# EAGLE schematic MPC_celltesterV1.0 (EAGLE 9.6.2)
DESIGNER: Juan J. Rojas; INSTITUTION: Instituto Tecnológico de Costa Rica; PROJECT_NAME: BDC_Prototype; VERSION: 1.1
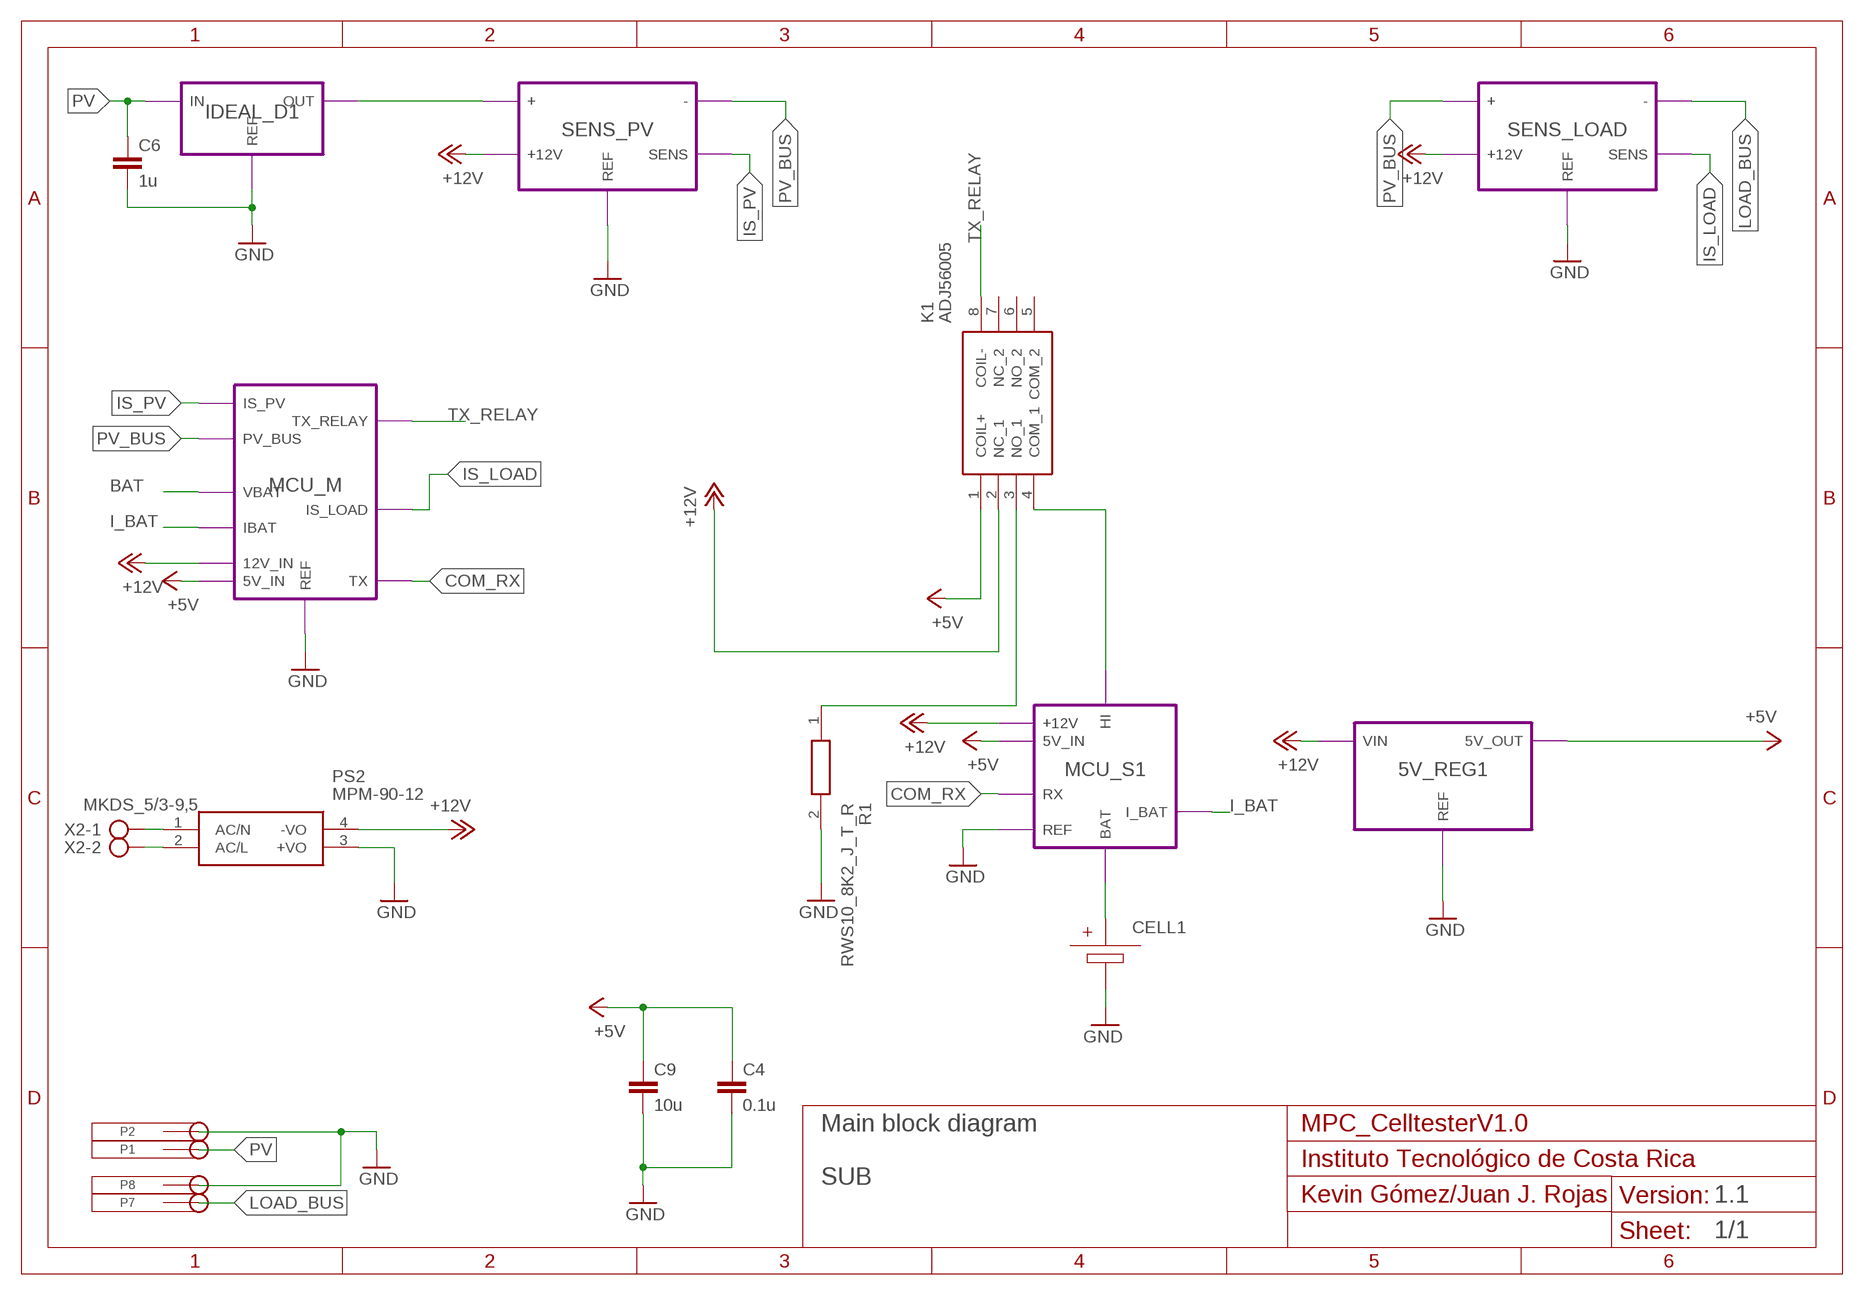
[diagram p0: schematic, sheet 1]
FRAME1 (A4L-JUANJO): DESIGNER: Kevin Gómez/Juan J. Rojas; PROJECT_NAME: MPC_CelltesterV1.0; SUBTITLE: SUB; TITLE: Main block diagram

## Parts
C4  0.1u  NONPOL_CAP-0603  [C0603]
C6  1u  NONPOL_CAP-0603  [C0603]
C9  10u  NONPOL_CAP-0603  [C0603]
CELL1  CELL18650_HOLDER  [18650_HOLDER]
K1  ADJ56005  [ADJ56005]
P1  TJ-563  [TJ-563]
P2  TJ-563  [TJ-563]
P7  TJ-563  [TJ-563]
P8  TJ-563  [TJ-563]
PS2  MPM-90-12  [MPM9012]
R1  RWS10_8K2_J_T_R  [RWS108K2JTR]
X2  MKDS_5/3-9,5  [MKDS_5/3-950]

## Module instances
MCU_S1 = BIDIRECTIONAL_CONVERTER (part numbers offset by 100)
SENS_PV = BI_CURR_MEAS (part numbers offset by 500)
SENS_LOAD = BI_CURR_MEAS (part numbers offset by 600)
5V_REG1 = 5V_REGULATOR (part numbers offset by 800)
IDEAL_D1 = IDEAL_DIODE (part numbers offset by 1100)
MCU_M = CONTROLLER$A

## Nets
+5V: C4.1 C9.1 K1.1(COIL+) ; port 5V_REG1.5V_OUT MCU_S1.5V_IN MCU_M.5V_IN
+12V: K1.2(NC_1) PS2.4(-VO) ; port MCU_M.12V_IN MCU_S1.+12V SENS_PV.+12V SENS_LOAD.+12V 5V_REG1.VIN
BAT: port MCU_M.VBAT
COM_RX: port MCU_S1.RX MCU_M.TX
GND: C4.2 C6.2 C9.2 CELL1.BB1.N(-) P2.P(PIN) P8.P(PIN) PS2.3(+VO) R1.2 ; port MCU_S1.REF SENS_PV.REF SENS_LOAD.REF IDEAL_D1.REF 5V_REG1.REF MCU_M.REF
I_BAT: port MCU_M.IBAT MCU_S1.I_BAT
IS_LOAD: port SENS_LOAD.SENS MCU_M.IS_LOAD
IS_PV: port SENS_PV.SENS MCU_M.IS_PV
LOAD_BUS: P7.P(PIN) ; port SENS_LOAD.-
N$1: CELL1.BB1.P(+) ; port MCU_S1.BAT
N$2: K1.3(NO_1) R1.1
N$3: PS2.1(AC/N) X2.1
N$4: PS2.2(AC/L) X2.2
N$6: port SENS_PV.+ IDEAL_D1.OUT
PV: C6.1 P1.P(PIN) ; port IDEAL_D1.IN
PV_BUS: K1.4(COM_1) ; port SENS_PV.- SENS_LOAD.+ MCU_M.PV_BUS
TX_RELAY: K1.8(COIL-) ; port MCU_M.TX_RELAY
Unconnected: K1.5(COM_2) K1.6(NO_2) K1.7(NC_2) X2.3

## Library data of the parts
C4 C6 C9 = Pasives:NONPOL_CAP
CELL1 = Sources:CELL
K1 = ADJ56005:ADJ56005: General Purpose Relays 2 Form C, 5VDC Single-Side-Stable Source: Datasheet <https://www.arrow.com/en/products/adj56005/panasonic>; ARROW_PART_NUMBER: ADJ56005; ARROW_PRICE-STOCK: https://www.arrow.com/en/products/adj56005/panasonic; DESCRIPTION: General Purpose Relays 2 Form C, 5VDC Single-Side-Stable; HEIGHT: 16.8mm; MANUFACTURER_NAME: Panasonic; MANUFACTURER_PART_NUMBER: ADJ56005; MOUSER_PART_NUMBER: 769-ADJ56005; MOUSER_PRICE-STOCK: https://www.mouser.co.uk/ProductDetail/Panasonic-Industrial-Devices/ADJ56005?qs=K19snyAz2PDLYPJLi5JsPw%3D%3D
P1 P2 P7 P8 = Interfaces:TJ-563
PS2 = MPM-90-12:MPM-90-12: AC/DC Power Modules 80.4W 12V 6.7A PCB Mnt Medical Source: Datasheet <https://www.meanwell.com/webapp/product/search.aspx?prod=MPM-90#1>; ARROW_PART_NUMBER: MPM-90-12; ARROW_PRICE-STOCK: https://www.arrow.com/en/products/mpm-90-12/mean-well-enterprises; DESCRIPTION: AC/DC Power Modules 80.4W 12V 6.7A PCB Mnt Medical; HEIGHT: 29.5mm; MANUFACTURER_NAME: Mean Well; MANUFACTURER_PART_NUMBER: MPM-90-12; MOUSER_PART_NUMBER: 709-MPM-90-12; MOUSER_PRICE-STOCK: https://www.mouser.co.uk/ProductDetail/MEAN-WELL/MPM-90-12?qs=GBLSl2AkirsaepJLNG9d8w%3D%3D
R1 = RWS10_8K2_J_T&R:RWS10_8K2_J_T_R: Precision Power Wirewound SMD Resistors Source: Datasheet <https://www.mouser.es/datasheet/2/303/RWS710-1-12.41-768831.pdf>; DESCRIPTION: Precision Power Wirewound SMD Resistors; HEIGHT: 13mm; MANUFACTURER_NAME: Arcol; MANUFACTURER_PART_NUMBER: RWS10 8K2 J T&R
X2 = con-phoenix-mkds_5:MKDS_5/3-: MKDS 5/3-6,35 Source: PHOENIX CONTACT; MF: FARNELL; MPN: 1714984; OC_FARNELL: 3704713; OC_NEWARK: 71C4094

## Module BIDIRECTIONAL_CONVERTER
Ports: REF(pwr) HI(io) +12V(pwr) 5V_IN(pwr) RX(io) BAT(io) I_BAT(io)
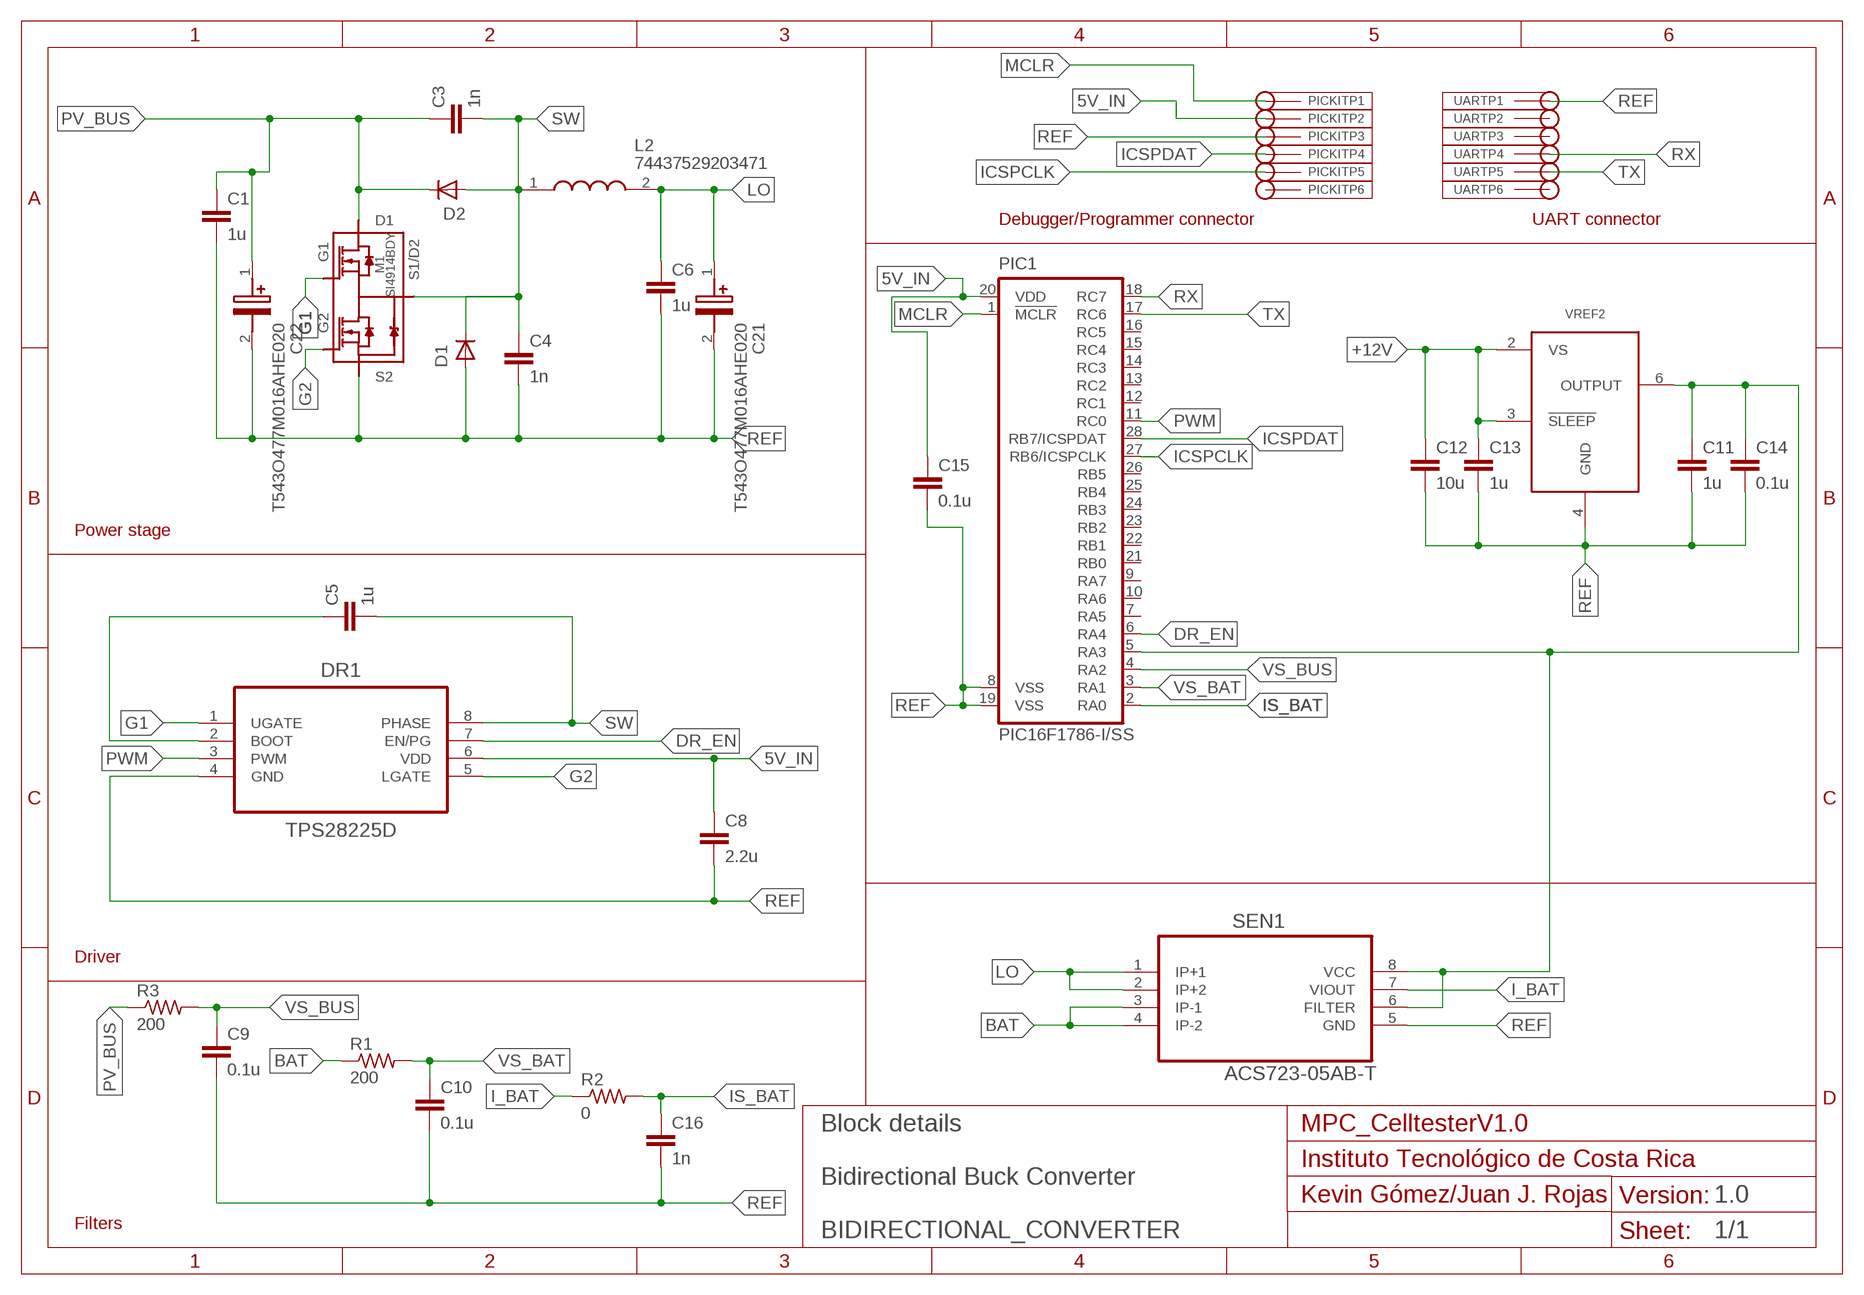
[diagram p1: schematic, module BIDIRECTIONAL_CONVERTER, sheet 1]
FRAME1 (A4L-JUANJO): DESIGNER: Kevin Gómez/Juan J. Rojas; PROJECT_NAME: MPC_CelltesterV1.0; SUBTITLE: Bidirectional Buck Converter; TITLE: Block details; VERSION: 1.0

### Parts
C1  1u  NONPOL_CAP-0603  [C0603]
C3  1n  NONPOL_CAP-0603  [C0603]
C4  1n  NONPOL_CAP-0603  [C0603]
C5  1u  NONPOL_CAP-0603  [C0603]
C6  1u  NONPOL_CAP-0603  [C0603]
C8  2.2u  NONPOL_CAP-0603  [C0603]
C9  0.1u  NONPOL_CAP-0603  [C0603]
C10  0.1u  NONPOL_CAP-0603  [C0603]
C11  1u  NONPOL_CAP-0603  [C0603]
C12  10u  NONPOL_CAP-0603  [C0603]
C13  1u  NONPOL_CAP-0603  [C0603]
C14  0.1u  NONPOL_CAP-0603  [C0603]
C15  0.1u  NONPOL_CAP-0603  [C0603]
C16  1n  NONPOL_CAP-0603  [C0603]
C21  T543O477M016AHE020  [CAPPM7360X430N]
C22  T543O477M016AHE020  [CAPPM7360X430N]
D1  DIODE-SMB  [SMB]
D2  DIODE-SMB  [SMB]
DR1  TPS28225D  [SOIC-8]
L2  74437529203471  [74437529203221]
M1  SI4914BDY  [SOIC-8]
PIC1  PIC16F1786-I/SS  [SSOP28]
PICKIT  MA06-1  [MA06-1]
R1  200  RESISTOR-0603  [R0603]
R2  0  RESISTOR-0603  [R0603]
R3  200  RESISTOR-0603  [R0603]
SEN1  ACS723-05AB-T  [SOIC-8]
UART  MA06-1  [MA06-1]
VREF2  REF195GSZ  [SOIC-8]

### Nets
5V_IN: C8.1 C15.1 DR1.6(VDD) PIC1.20(VDD) PICKIT.2
5V_REF: C11.1 C14.1 PIC1.5(RA3) SEN1.6(FILTER) SEN1.8(VCC) VREF2.6(OUTPUT)
+12V: C12.1 C13.1 VREF2.2(VS) VREF2.3(!SLEEP!)
BAT: R1.1 SEN1.3(IP-1) SEN1.4(IP-2)
DR_EN: DR1.7(EN/PG) PIC1.6(RA4)
G1: DR1.1(UGATE) M1.8(G1)
G2: DR1.5(LGATE) M1.3(G2)
I_BAT: R2.1 SEN1.7(VIOUT)
ICSPCLK: PIC1.27(RB6/ICSPCLK) PICKIT.5
ICSPDAT: PIC1.28(RB7/ICSPDAT) PICKIT.4
IS_BAT: C16.1 PIC1.2(RA0) R2.2
LO: C6.1 C21.1(+) L2.2 SEN1.1(IP+1) SEN1.2(IP+2)
MCLR: PIC1.1(!MCLR) PICKIT.1
N$2: C5.1 DR1.2(BOOT)
PV_BUS: C1.1 C3.1 C22.1(+) D2.C M1.1(D1) M1.2(D1) R3.1
PWM: DR1.3(PWM) PIC1.11(RC0)
REF: C1.2 C4.2 C6.2 C8.2 C9.2 C10.2 C11.2 C12.2 C13.2 C14.2 C15.2 C16.2 C21.2(-) C22.2(-) D1.A DR1.4(GND) M1.4(S2) PIC1.8(VSS) PIC1.19(VSS) PICKIT.3 SEN1.5(GND) UART.1 VREF2.4(GND)
RX: PIC1.18(RC7) UART.4
SW: C3.2 C4.1 C5.2 D1.C D2.A DR1.8(PHASE) L2.1 M1.5(S1/D2) M1.6(S1/D2) M1.7(S1/D2)
TX: PIC1.17(RC6) UART.5
VS_BAT: C10.1 PIC1.3(RA1) R1.2
VS_BUS: C9.1 PIC1.4(RA2) R3.2
Unconnected: PIC1.7(RA5) PIC1.9(RA7) PIC1.10(RA6) PIC1.12(RC1) PIC1.13(RC2) PIC1.14(RC3) PIC1.15(RC4) PIC1.16(RC5) PIC1.21(RB0) PIC1.22(RB1) PIC1.23(RB2) PIC1.24(RB3) PIC1.25(RB4) PIC1.26(RB5) PICKIT.6 UART.2 UART.3 UART.6

### Notes on the sheet
- Debugger/Programmer connector | UART connector
- Power stage
- Driver
- Filters

### Library data of the parts
C1 C3-C6 C8-C16 = Pasives:NONPOL_CAP
C21 C22 = T543O477M016AHE020:T543O477M016AHE020: T543 HRA, Tantalum, Polymer Tantalum, HRA, 470 uF, 20%, 16 VDC, 105C, -55C, 105C, SMD, Polymer, Molded, Up Screening, 10 % , N/A, 20 mOhms, 752 uA, 696 mg, 7360, 4mm, Height Max = 4.3mm, 250, 52 Weeks Source: Datasheet <https://content.kemet.com/datasheets/KEM_T2061_T543.pdf>; ARROW_PART_NUMBER: T543O477M016AHE020; ARROW_PRICE-STOCK: https://www.arrow.com/en/products/t543o477m016ahe020/kemet-corporation; DESCRIPTION: T543 HRA, Tantalum, Polymer Tantalum, HRA, 470 uF, 20%, 16 VDC, 105C, -55C, 105C, SMD, Polymer, Molded, Up Screening, 10 % , N/A, 20 mOhms, 752 uA, 696 mg, 7360, 4mm, Height Max = 4.3mm, 250, 52 Weeks; HEIGHT: 4.3mm; MANUFACTURER_NAME: KEMET; MANUFACTURER_PART_NUMBER: T543O477M016AHE020; MOUSER_PART_NUMBER: 80-T543O477M016AHE20; MOUSER_PRICE-STOCK: https://www.mouser.co.uk/ProductDetail/KEMET/T543O477M016AHE020/?qs=r5DSvlrkXmJq%252BXsyQPO%252BEg%3D%3D
D1 D2 = Pasives:DIODE
DR1 = ICs:TPS28225D
L2 = 74437529203471:74437529203471: WURTH ELEKTRONIK - 74437529203471 - Power Inductor (SMD), 470 H, 5.5 A, Shielded, 3.7 A, WE-HCF Series, 28mm x 25mm x 20.5mm Source: Datasheet <https://www.we-online.de/katalog/datasheet/74437529203471.pdf>; DESCRIPTION: WURTH ELEKTRONIK - 74437529203471 - Power Inductor (SMD), 470 H, 5.5 A, Shielded, 3.7 A, WE-HCF Series, 28mm x 25mm x 20.5mm; HEIGHT: 20.5mm; MANUFACTURER_NAME: Wurth Elektronik; MANUFACTURER_PART_NUMBER: 74437529203471; MOUSER_PART_NUMBER: 710-74437529203471; MOUSER_PRICE-STOCK: https://www.mouser.co.uk/ProductDetail/Wurth-Elektronik/74437529203471?qs=f9yNj16SXrIPviz1ofhdNA%3D%3D
M1 = ICs:SI4914BDY
PIC1 = ICs:PIC16F1786
PICKIT UART = Interfaces:MA06-1: PIN HEADER; OC_FARNELL: unknown; OC_NEWARK: unknown
R1-R3 = Pasives:RESISTOR: RESISTOR
SEN1 = ICs:ACS723-05AB-T: Hall Effect-Based Linear Current Sensor IC - 5A
VREF2 = ICs:REF195GSZ

## Module DRIVER_MODULE
Ports: G1(io) SW(io) G2(io) REF(io) VDD(io) PWM(io)
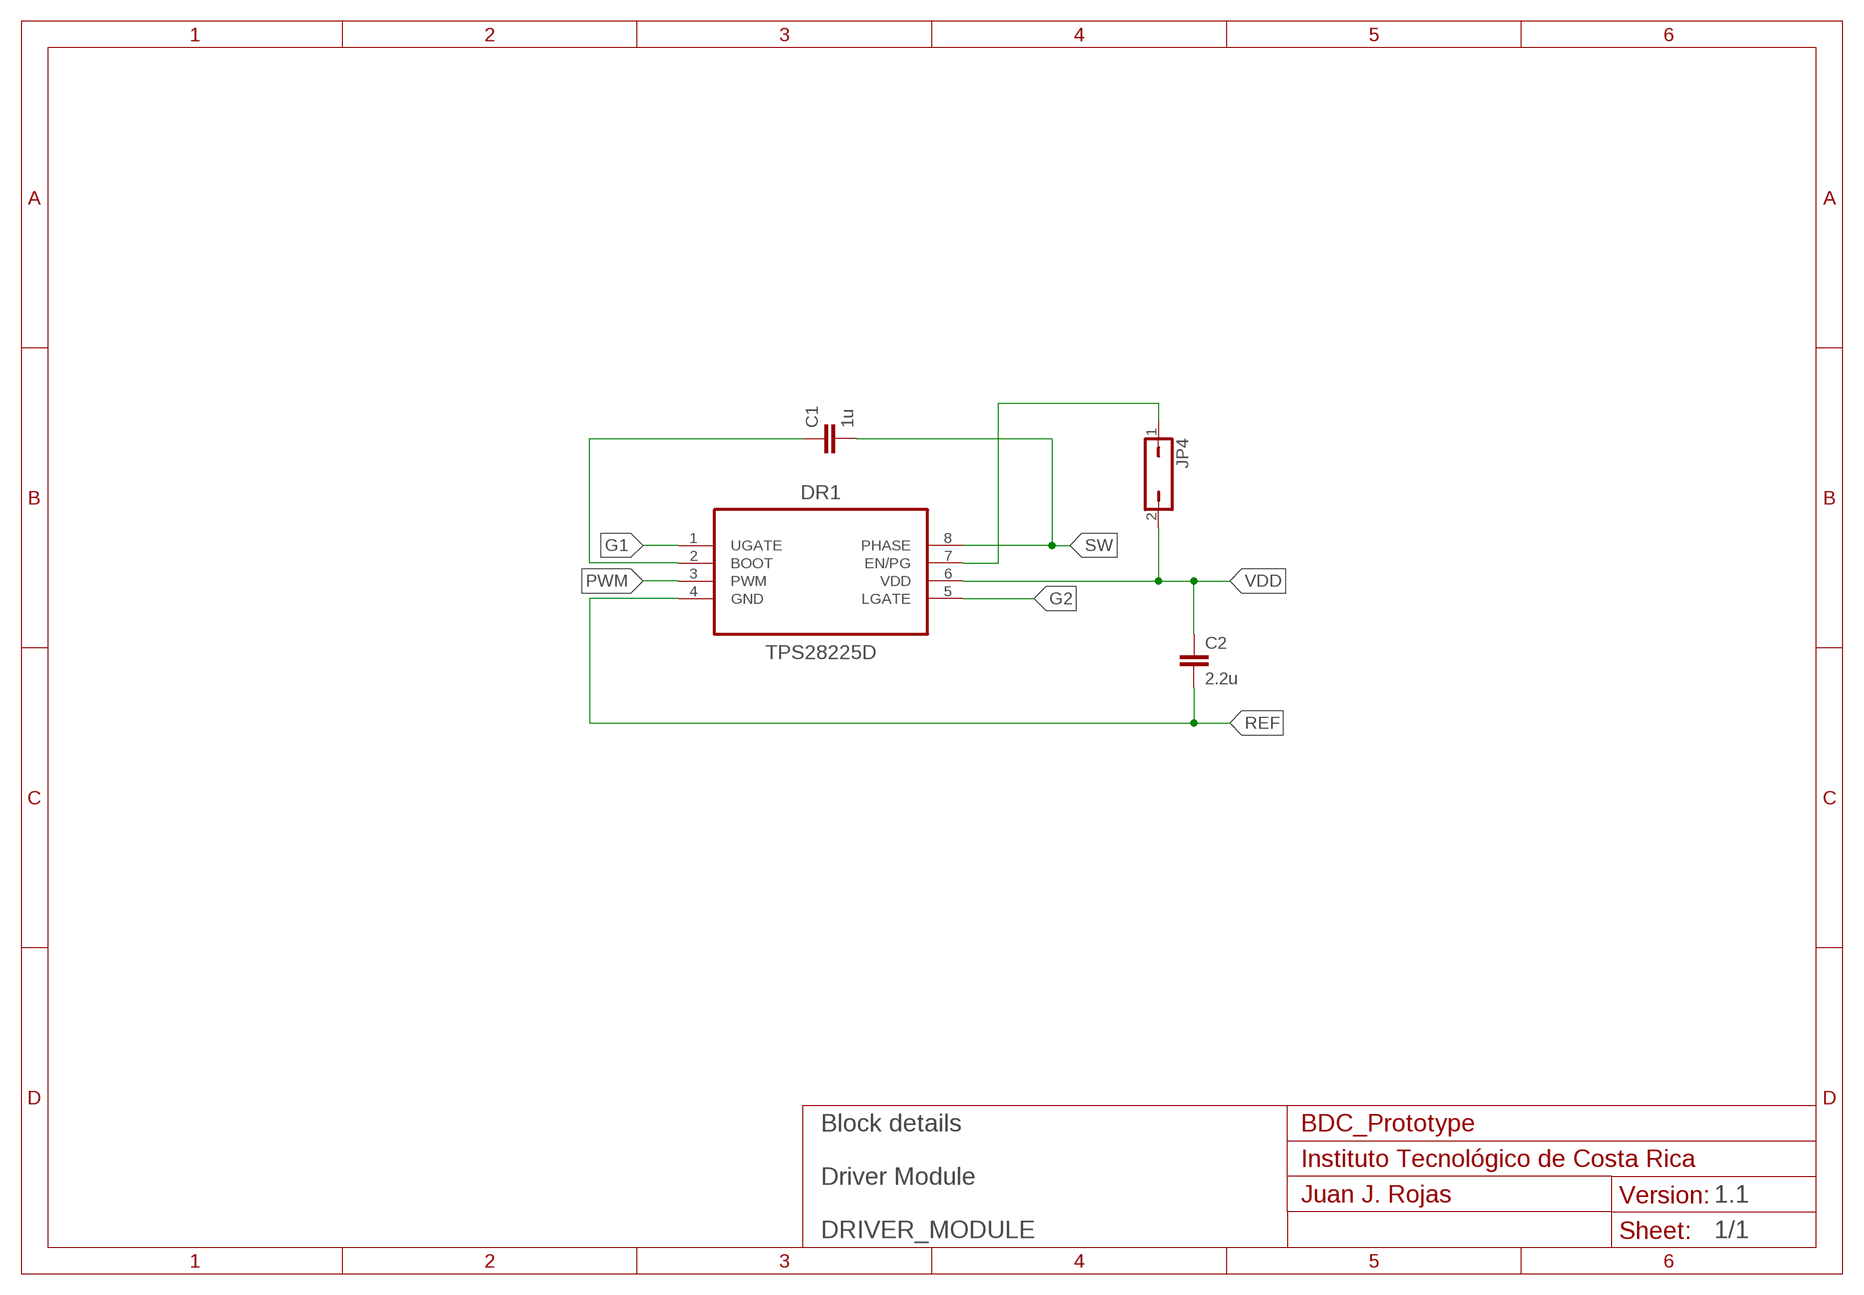
[diagram p2: schematic, module DRIVER_MODULE, sheet 1]
FRAME1 (A4L-JUANJO): SUBTITLE: Driver Module; TITLE: Block details

### Parts
C1  1u  NONPOL_CAP-0603  [C0603]
C2  2.2u  NONPOL_CAP-0603  [C0603]
DR1  TPS28225D  [SOIC-8]
JP4  J2PSINGLE  [J2P]

### Nets
G1: DR1.1(UGATE)
G2: DR1.5(LGATE)
N$1: DR1.7(EN/PG) JP4.1
N$2: C1.1 DR1.2(BOOT)
PWM: DR1.3(PWM)
REF: C2.2 DR1.4(GND)
SW: C1.2 DR1.8(PHASE)
VDD: C2.1 DR1.6(VDD) JP4.2

### Library data of the parts
C1 C2 = Pasives:NONPOL_CAP
DR1 = ICs:TPS28225D
JP4 = Interfaces:J2P: JUMPER

## Module BI_CURR_MEAS
Ports: REF(pwr) +(io) -(io) SENS(io) +12V(pwr)
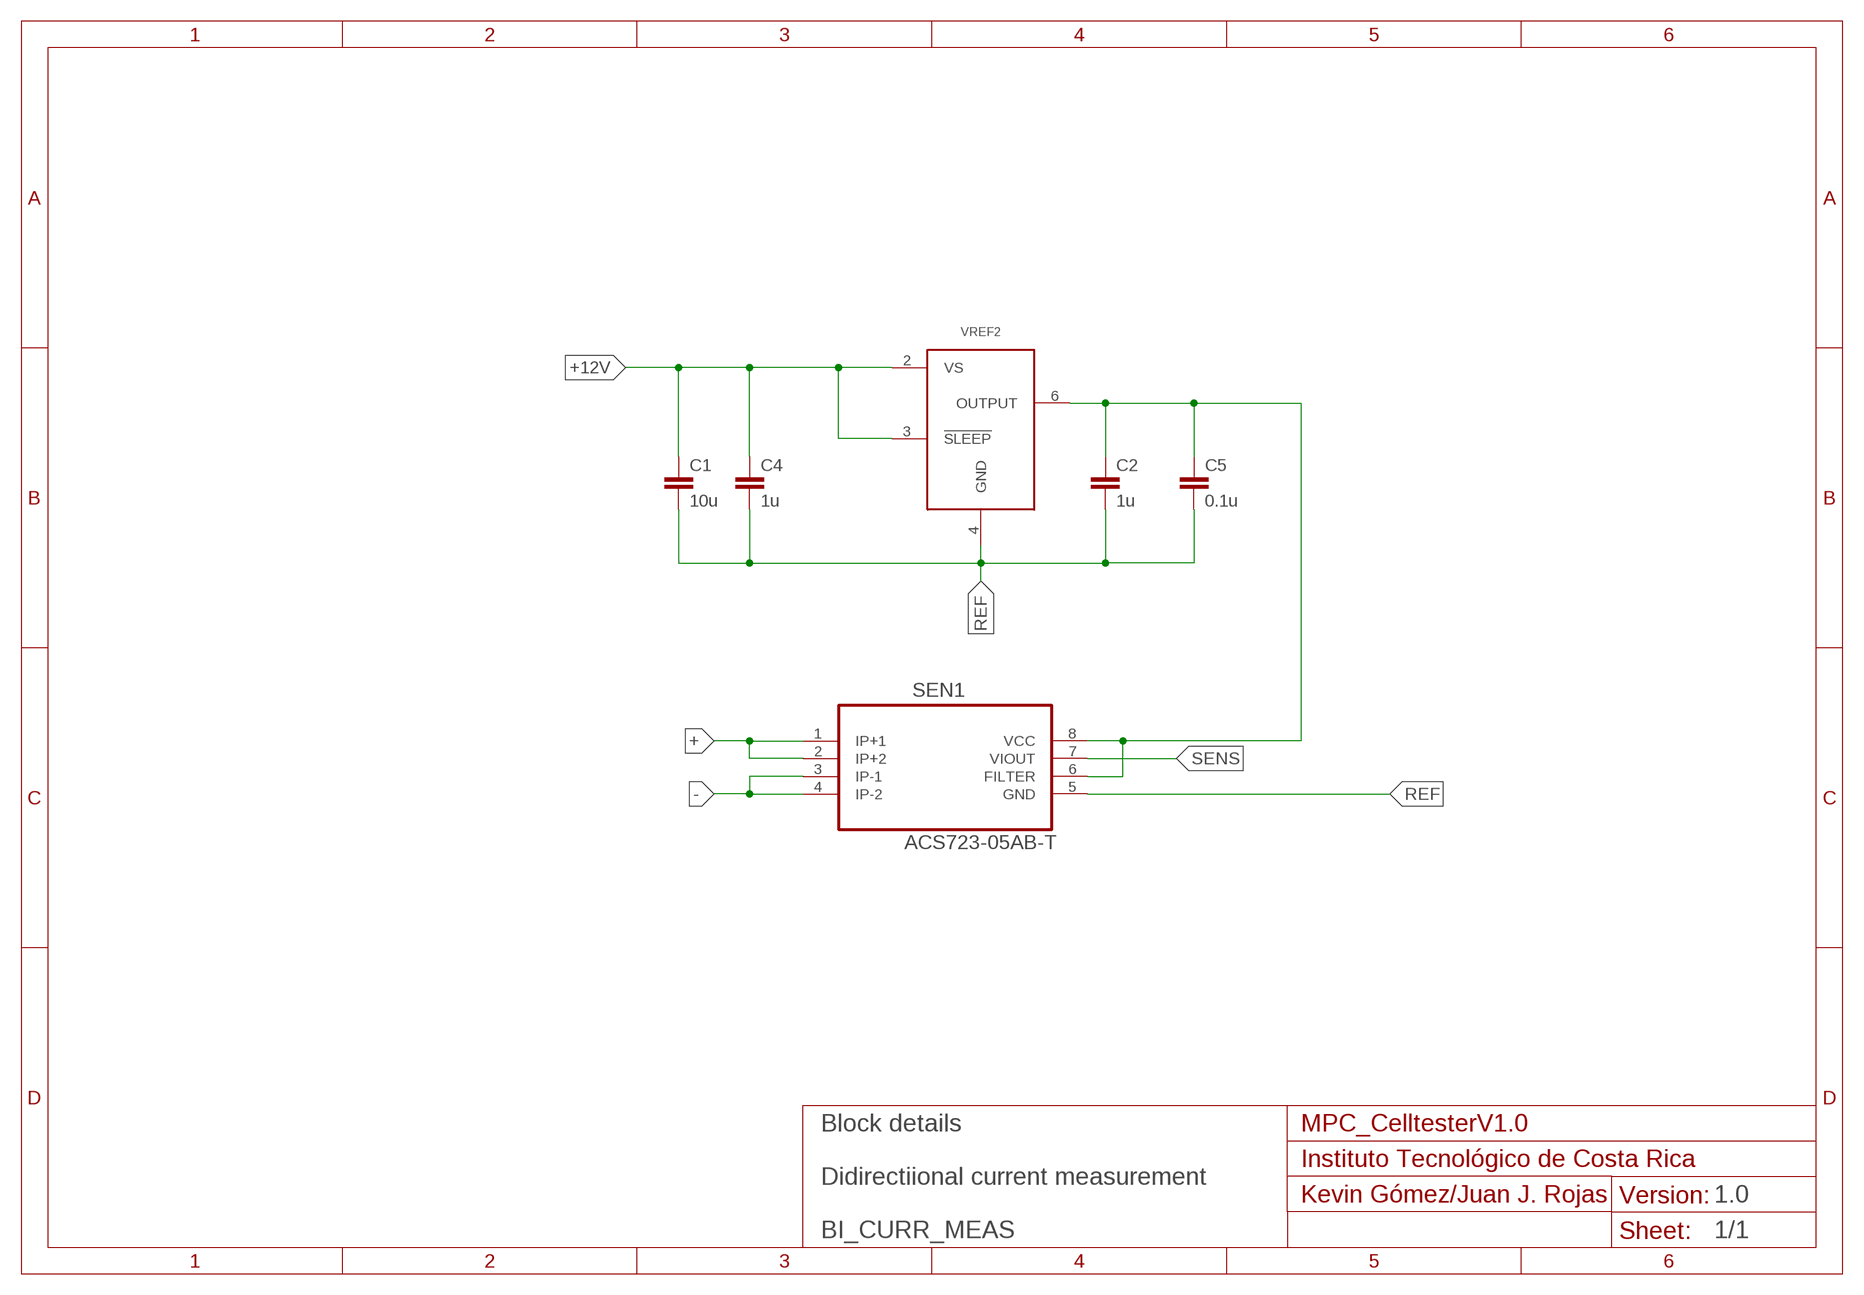
[diagram p3: schematic, module BI_CURR_MEAS, sheet 1]
FRAME2 (A4L-JUANJO): DESIGNER: Kevin Gómez/Juan J. Rojas; PROJECT_NAME: MPC_CelltesterV1.0; SUBTITLE: Didirectiional current measurement; TITLE: Block details; VERSION: 1.0

### Parts
C1  10u  NONPOL_CAP-0603  [C0603]
C2  1u  NONPOL_CAP-0603  [C0603]
C4  1u  NONPOL_CAP-0603  [C0603]
C5  0.1u  NONPOL_CAP-0603  [C0603]
SEN1  ACS723-05AB-T  [SOIC-8]
VREF2  REF195GSZ  [SOIC-8]

### Nets
5V_REF: C2.1 C5.1 SEN1.6(FILTER) SEN1.8(VCC) VREF2.6(OUTPUT)
+: SEN1.1(IP+1) SEN1.2(IP+2)
+12V: C1.1 C4.1 VREF2.2(VS) VREF2.3(!SLEEP!)
-: SEN1.3(IP-1) SEN1.4(IP-2)
REF: C1.2 C2.2 C4.2 C5.2 SEN1.5(GND) VREF2.4(GND)
SENS: SEN1.7(VIOUT)

### Library data of the parts
C1 C2 C4 C5 = Pasives:NONPOL_CAP
SEN1 = ICs:ACS723-05AB-T: Hall Effect-Based Linear Current Sensor IC - 5A
VREF2 = ICs:REF195GSZ

## Module 5V_REGULATOR
Ports: 5V_OUT(io) VIN(pwr) REF(pwr)
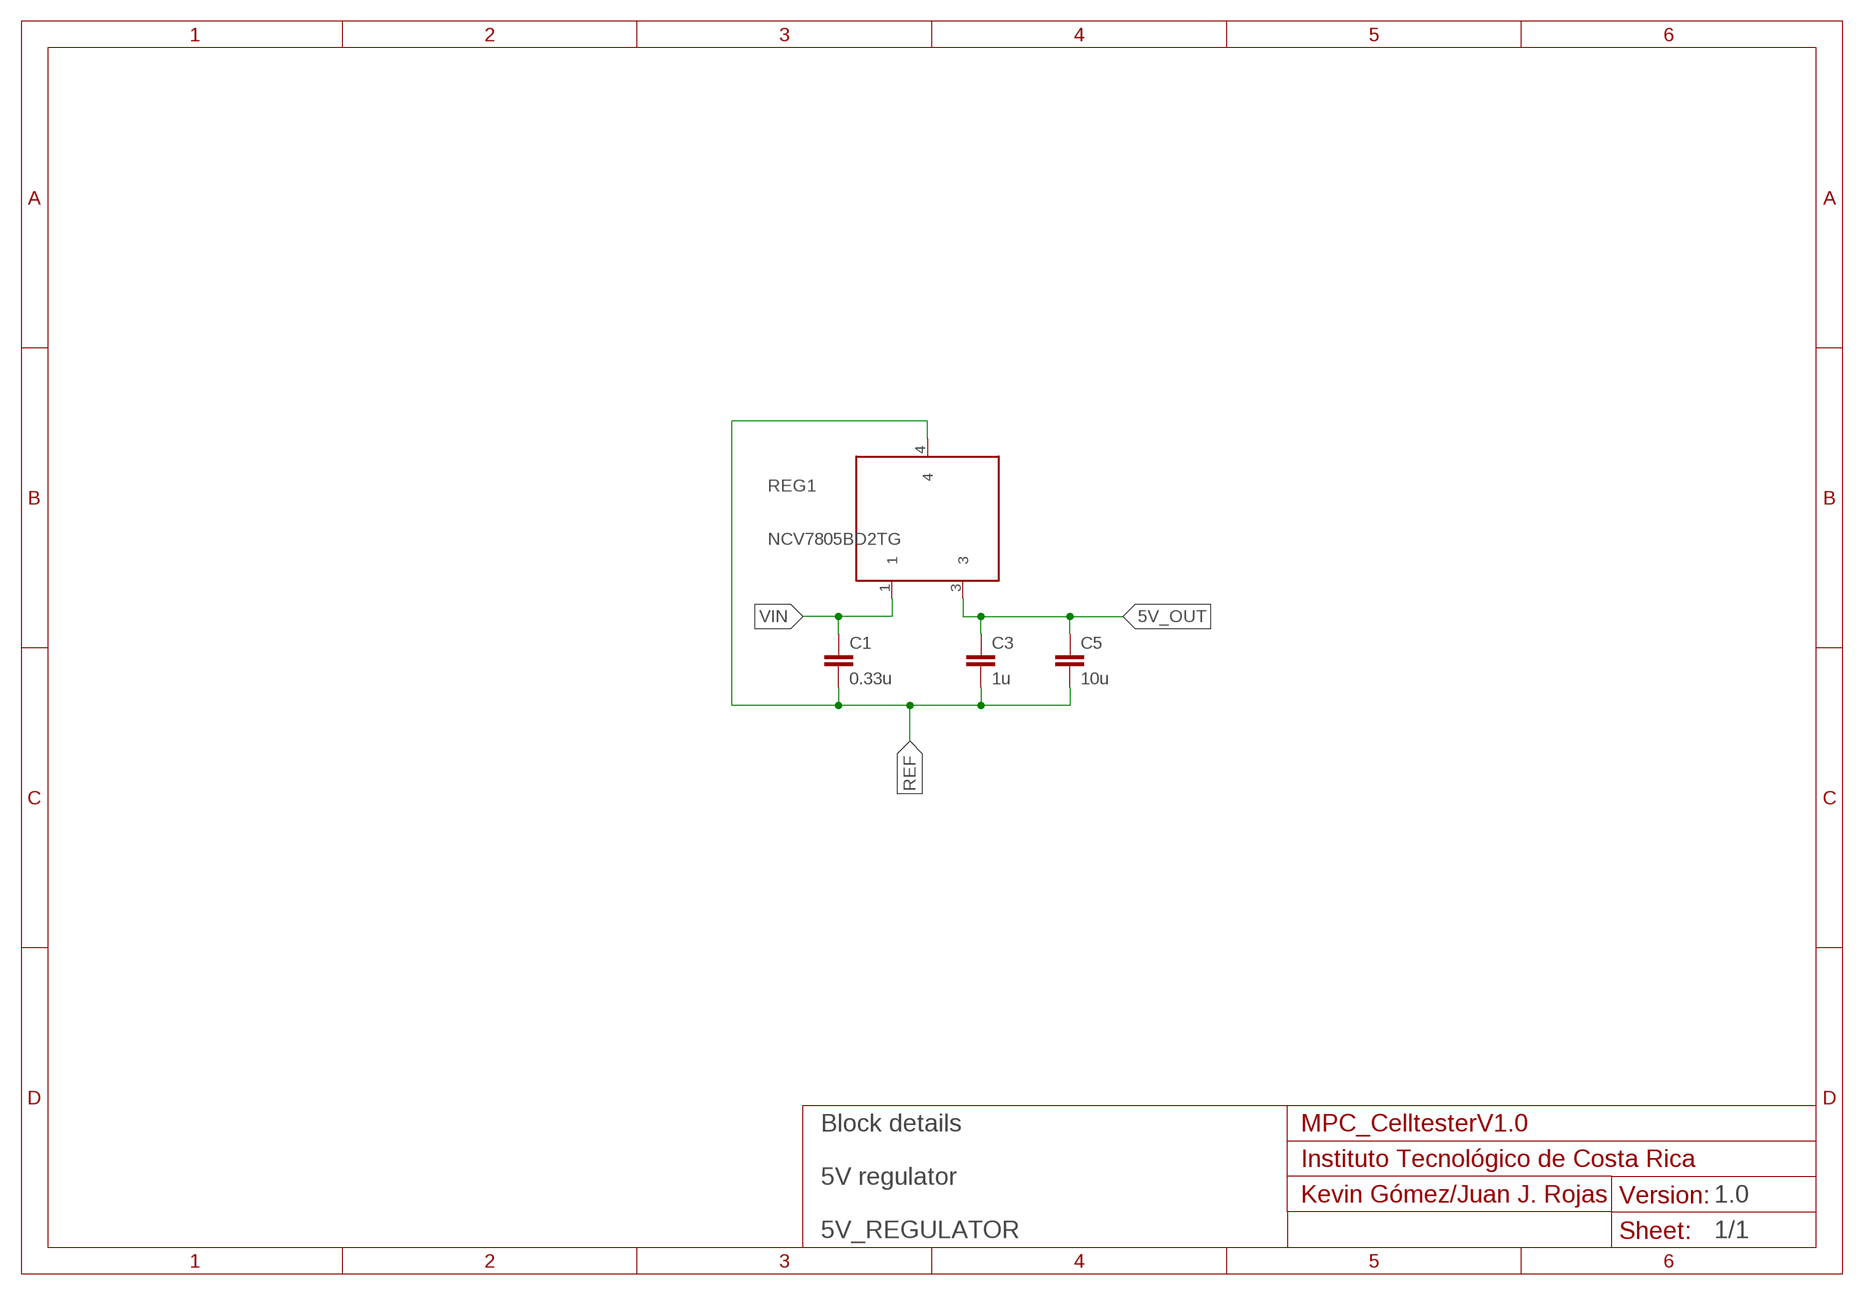
[diagram p4: schematic, module 5V_REGULATOR, sheet 1]
FRAME2 (A4L-JUANJO): DESIGNER: Kevin Gómez/Juan J. Rojas; PROJECT_NAME: MPC_CelltesterV1.0; SUBTITLE: 5V regulator; TITLE: Block details; VERSION: 1.0

### Parts
C1  0.33u  NONPOL_CAP-0603  [C0603]
C3  1u  NONPOL_CAP-0603  [C0603]
C5  10u  NONPOL_CAP-0603  [C0603]
REG1  NCV7805BD2TG  [D2PAK-3]

### Nets
5V_OUT: C3.1 C5.1 REG1.3
REF: C1.2 C3.2 C5.2 REG1.4
VIN: C1.1 REG1.1

### Library data of the parts
C1 C3 C5 = Pasives:NONPOL_CAP
REG1 = ICs:NCV7805BD2TG

## Module POWER_DISTRIBUTION_UNIT_5V
Ports: VIN(io) VOUT(io) SENS(io) ON(io) REF(pwr)
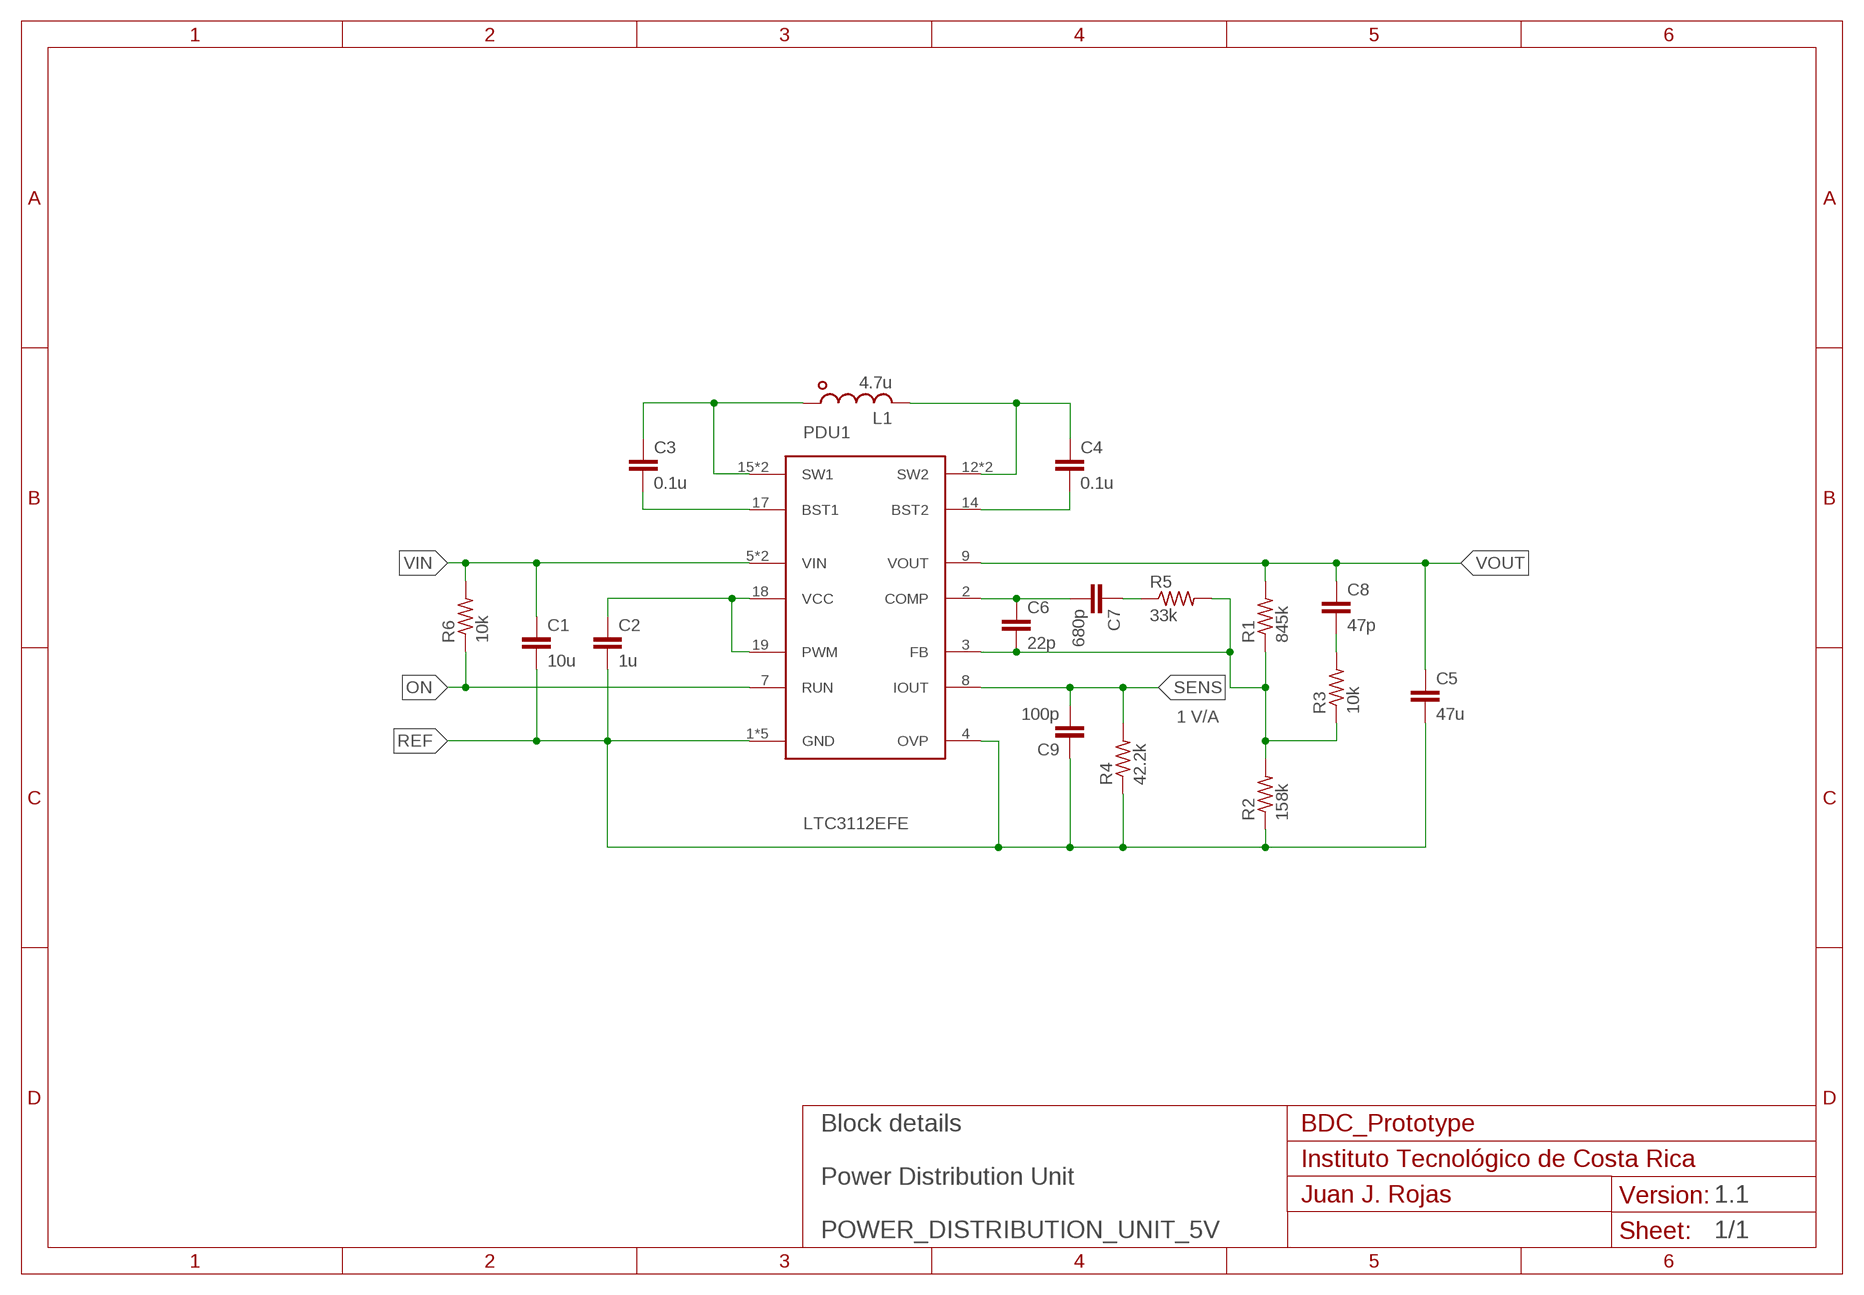
[diagram p5: schematic, module POWER_DISTRIBUTION_UNIT_5V, sheet 1]
FRAME2 (A4L-JUANJO): SUBTITLE: Power Distribution Unit; TITLE: Block details

### Parts
C1  10u  NONPOL_CAP-0603  [C0603]
C2  1u  NONPOL_CAP-0603  [C0603]
C3  0.1u  NONPOL_CAP-0603  [C0603]
C4  0.1u  NONPOL_CAP-0603  [C0603]
C5  47u  NONPOL_CAP-1210  [C1210]
C6  22p  NONPOL_CAP-0603  [C0603]
C7  680p  NONPOL_CAP-0603  [C0603]
C8  47p  NONPOL_CAP-0603  [C0603]
C9  100p  NONPOL_CAP-0603  [C0603]
L1  4.7u  INDUCTOR-SPM4020T  [SPM4020T]
PDU1  LTC3112EFE  [TSSOP20CA]
R1  845k  RESISTOR-0603  [R0603]
R2  158k  RESISTOR-0603  [R0603]
R3  10k  RESISTOR-0603  [R0603]
R4  42.2k  RESISTOR-0603  [R0603]
R5  33k  RESISTOR-0603  [R0603]
R6  10k  RESISTOR-0603  [R0603]

### Nets
N$1: C3.2 PDU1.17(BST1)
N$2: C2.1 PDU1.18(VCC) PDU1.19(PWM)
N$3: C4.2 PDU1.14(BST2)
N$4: C3.1 L1.1 PDU1.15(SW1) PDU1.16(SW1)
N$5: C7.1 R5.1
N$6: C6.1 C7.2 PDU1.2(COMP)
N$7: C4.1 L1.2 PDU1.12(SW2) PDU1.13(SW2)
N$8: C8.2 R3.2
N$9: C6.2 PDU1.3(FB) R1.1 R2.2 R3.1 R5.2
ON: PDU1.7(RUN) R6.1
REF: C1.2 C2.2 C5.2 C9.1 PDU1.1(GND) PDU1.4(OVP) PDU1.10(GND) PDU1.11(GND) PDU1.20(GND) PDU1.21(GND) R2.1 R4.1
SENS: C9.2 PDU1.8(IOUT) R4.2
VIN: C1.1 PDU1.5(VIN) PDU1.6(VIN) R6.2
VOUT: C5.1 C8.1 PDU1.9(VOUT) R1.2

### Notes on the sheet
- 1 V/A

### Library data of the parts
C1-C9 = Pasives:NONPOL_CAP
L1 = Pasives:INDUCTOR: SMD Power Inductor
PDU1 = ICs:LTC3112
R1-R6 = Pasives:RESISTOR: RESISTOR

## Module IDEAL_DIODE
Ports: IN(io) OUT(io) REF(pwr)
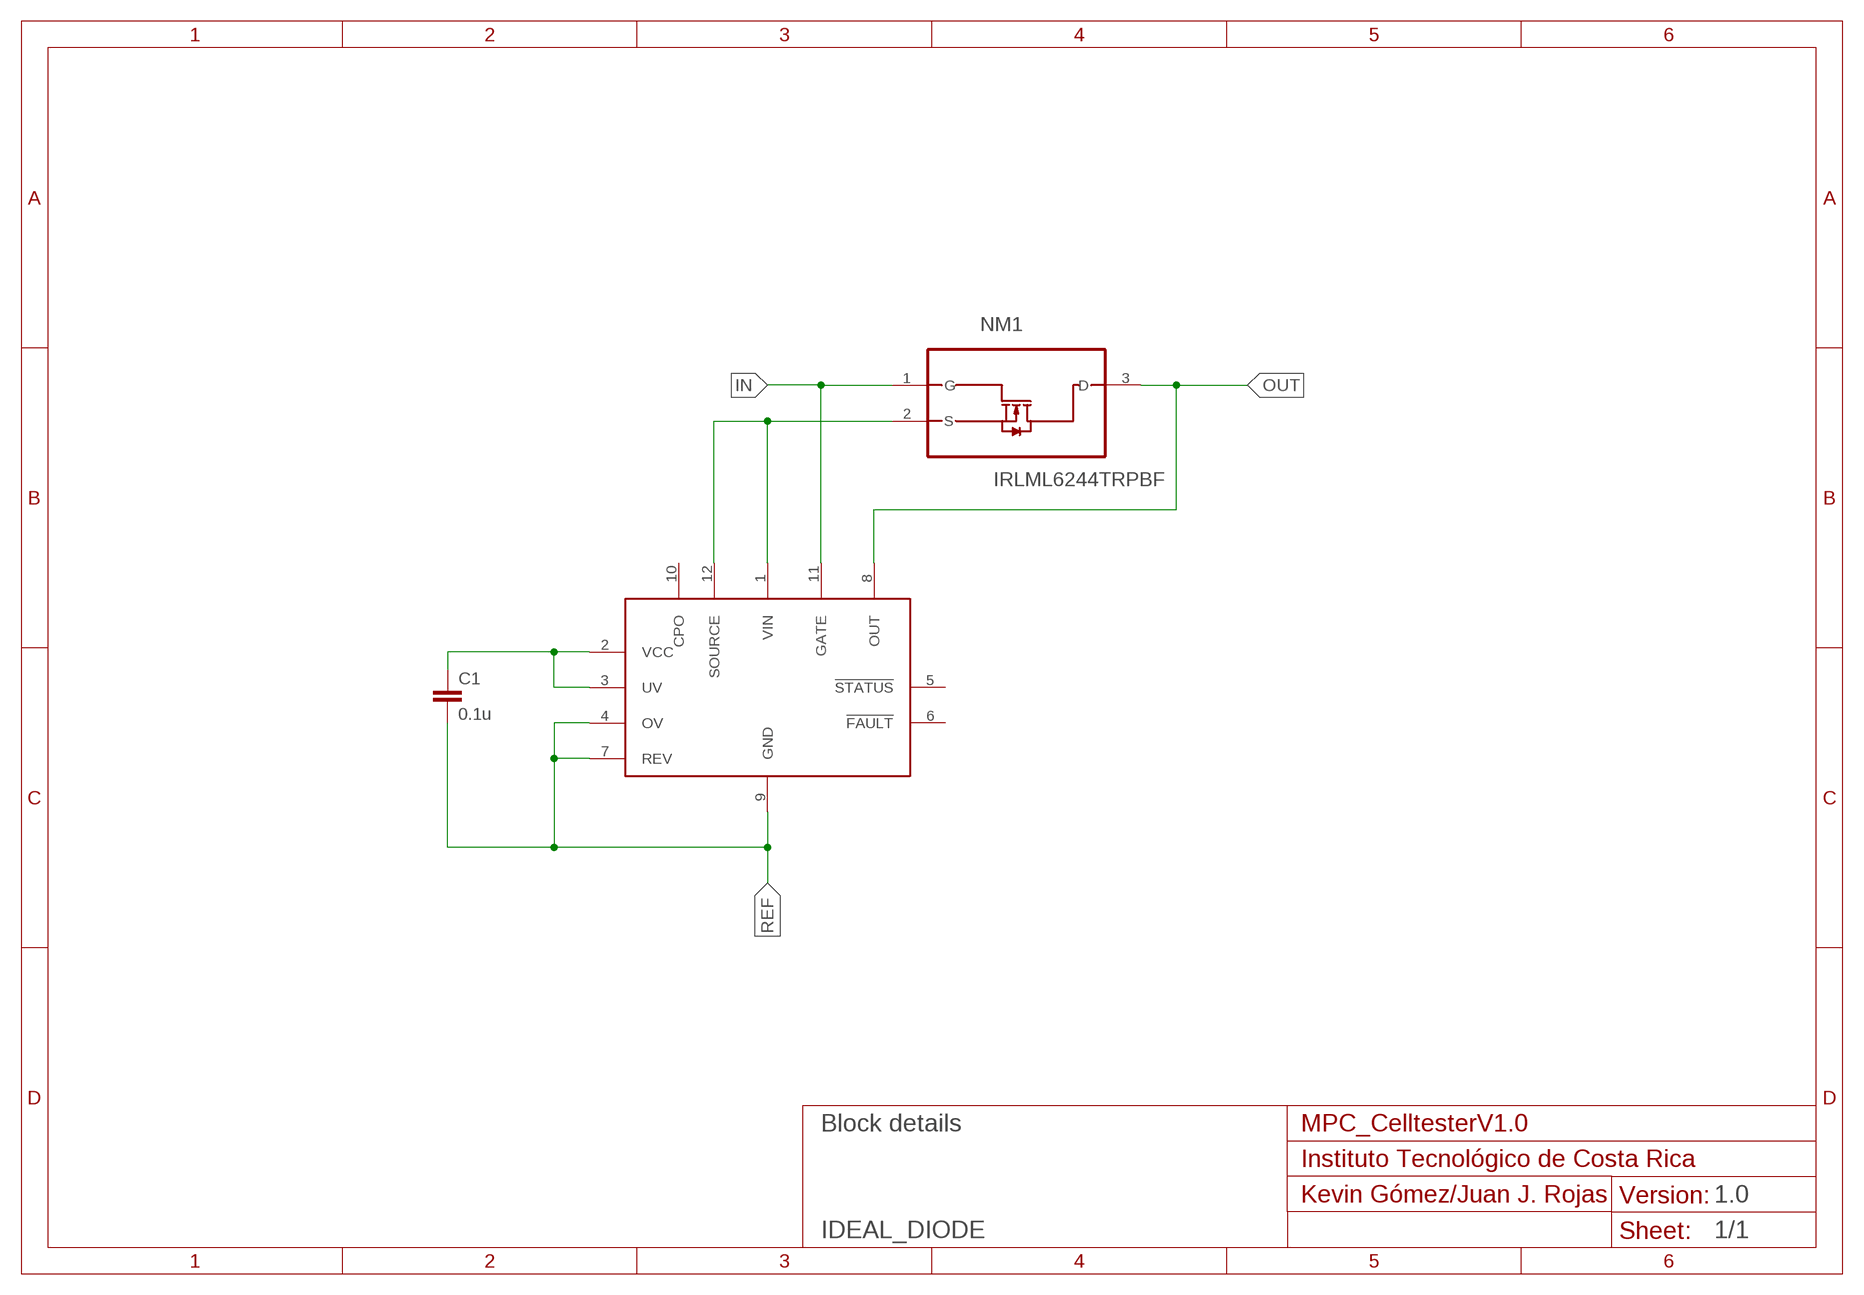
[diagram p6: schematic, module IDEAL_DIODE, sheet 1]
FRAME2 (A4L-JUANJO): DESIGNER: Kevin Gómez/Juan J. Rojas; PROJECT_NAME: MPC_CelltesterV1.0; TITLE: Block details; VERSION: 1.0

### Parts
C1  0.1u  NONPOL_CAP-0603  [C0603]
IDD1  LTC4352CMS  [MSOP12]
NM1  IRLML6244TRPBF  [SOT-23]

### Nets
IN: IDD1.11(GATE) NM1.1(G)
N$1: IDD1.1(VIN) IDD1.12(SOURCE) NM1.2(S)
N$4: C1.1 IDD1.2(VCC) IDD1.3(UV)
OUT: IDD1.8(OUT) NM1.3(D)
REF: C1.2 IDD1.4(OV) IDD1.7(REV) IDD1.9(GND)
Unconnected: IDD1.5(!STATUS) IDD1.6(!FAULT) IDD1.10(CPO)

### Library data of the parts
C1 = Pasives:NONPOL_CAP
IDD1 = ICs:LTC4352
NM1 = ICs:IRLML6244TRPBF: N-channel MOSFET, 6.3 A, 20 V HEXFET; RS_SN: 737-7228

## Module POWER_DISTRIBUTION_UNIT_3.3V
Ports: VIN(io) VOUT(io) ON(io) SENS(io) REF(io)
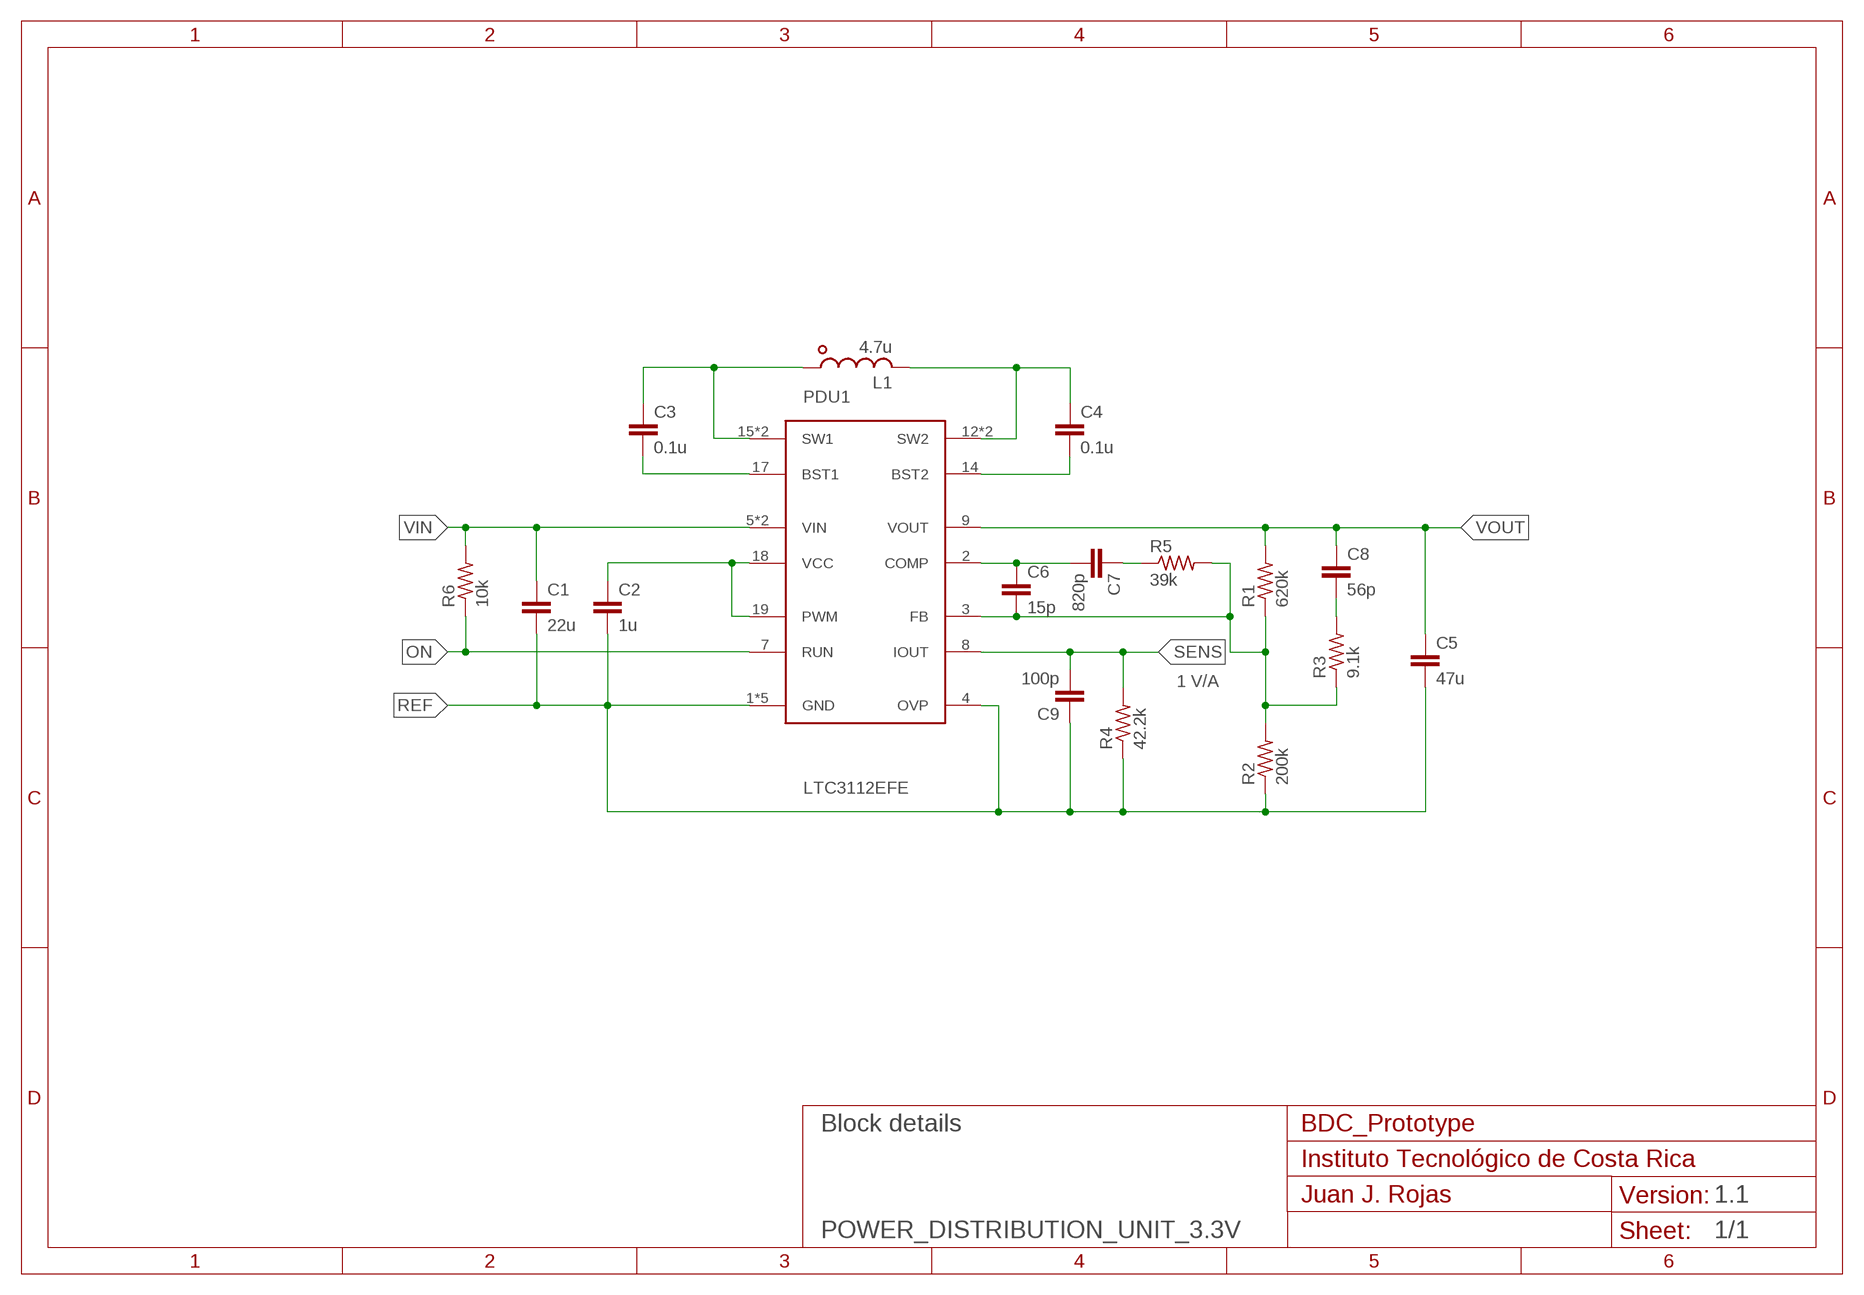
[diagram p7: schematic, module POWER_DISTRIBUTION_UNIT_3.3V, sheet 1]
FRAME2 (A4L-JUANJO): TITLE: Block details

### Parts
C1  22u  NONPOL_CAP-0603  [C0603]
C2  1u  NONPOL_CAP-0603  [C0603]
C3  0.1u  NONPOL_CAP-0603  [C0603]
C4  0.1u  NONPOL_CAP-0603  [C0603]
C5  47u  NONPOL_CAP-1210  [C1210]
C6  15p  NONPOL_CAP-0603  [C0603]
C7  820p  NONPOL_CAP-0603  [C0603]
C8  56p  NONPOL_CAP-0603  [C0603]
C9  100p  NONPOL_CAP-0603  [C0603]
L1  4.7u  INDUCTOR-SPM4020T  [SPM4020T]
PDU1  LTC3112EFE  [TSSOP20CA]
R1  620k  RESISTOR-0603  [R0603]
R2  200k  RESISTOR-0603  [R0603]
R3  9.1k  RESISTOR-0603  [R0603]
R4  42.2k  RESISTOR-0603  [R0603]
R5  39k  RESISTOR-0603  [R0603]
R6  10k  RESISTOR-0603  [R0603]

### Nets
N$1: C3.2 PDU1.17(BST1)
N$2: C2.1 PDU1.18(VCC) PDU1.19(PWM)
N$3: C4.2 PDU1.14(BST2)
N$4: C3.1 L1.1 PDU1.15(SW1) PDU1.16(SW1)
N$5: C7.1 R5.1
N$6: C6.1 C7.2 PDU1.2(COMP)
N$7: C4.1 L1.2 PDU1.12(SW2) PDU1.13(SW2)
N$8: C8.2 R3.2
N$9: C6.2 PDU1.3(FB) R1.1 R2.2 R3.1 R5.2
ON: PDU1.7(RUN) R6.1
REF: C1.2 C2.2 C5.2 C9.1 PDU1.1(GND) PDU1.4(OVP) PDU1.10(GND) PDU1.11(GND) PDU1.20(GND) PDU1.21(GND) R2.1 R4.1
SENS: C9.2 PDU1.8(IOUT) R4.2
VIN: C1.1 PDU1.5(VIN) PDU1.6(VIN) R6.2
VOUT: C5.1 C8.1 PDU1.9(VOUT) R1.2

### Notes on the sheet
- 1 V/A

### Library data of the parts
C1-C9 = Pasives:NONPOL_CAP
L1 = Pasives:INDUCTOR: SMD Power Inductor
PDU1 = ICs:LTC3112
R1-R6 = Pasives:RESISTOR: RESISTOR

## Module CONTROLLER
Ports: 5V_IN(pwr) 7.5V_IN(pwr) TX(io) IS_PV(io) PV_BUS(io) REF(pwr) IS_LOAD(io) IS_PDU_3.3V(io) IS_PDU_5V(io) 3.3V_PL(io) 5V_PL(io)
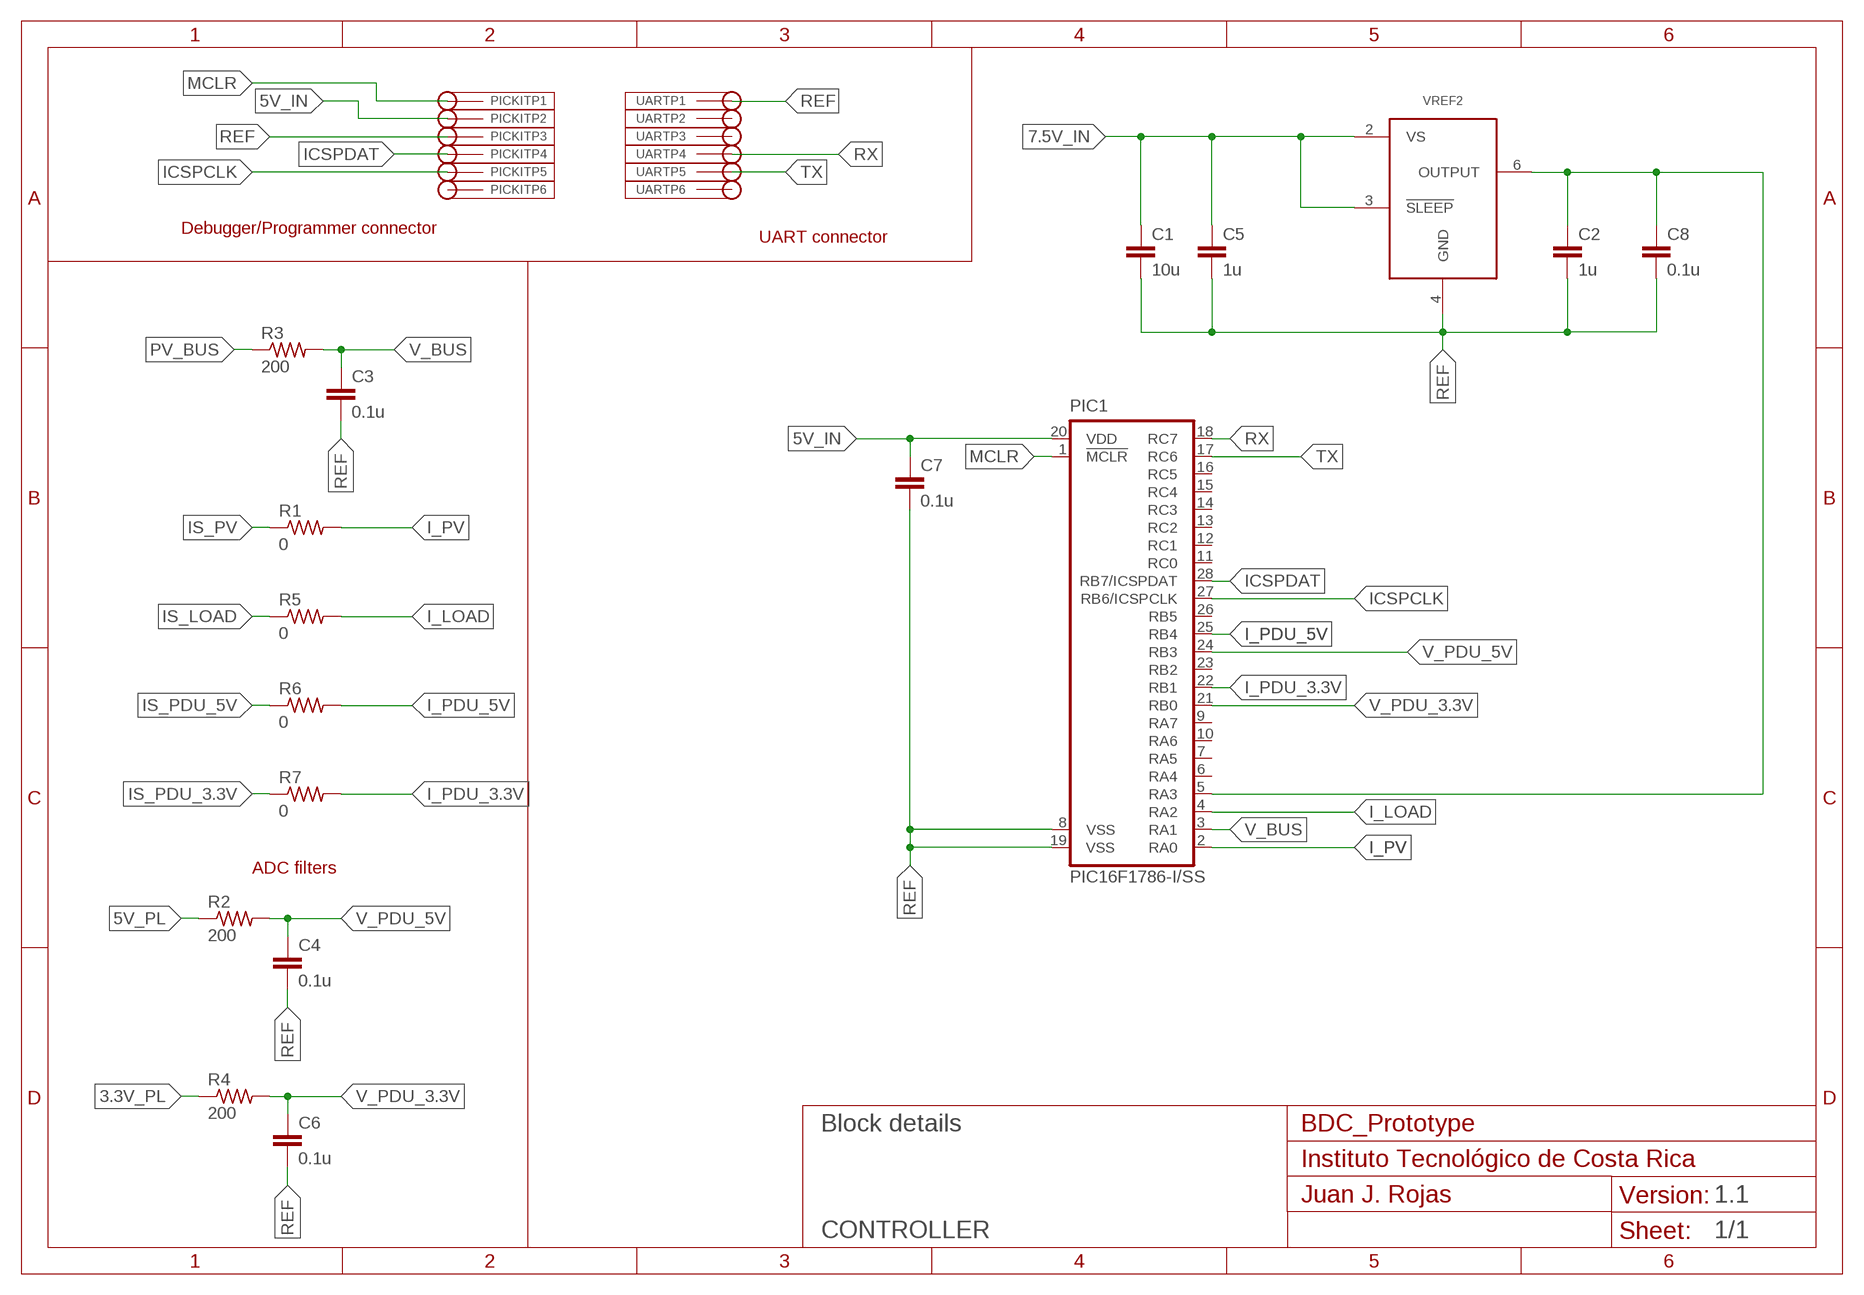
[diagram p8: schematic, module CONTROLLER, sheet 1]
FRAME2 (A4L-JUANJO): TITLE: Block details

### Parts
C1  10u  NONPOL_CAP-0603  [C0603]
C2  1u  NONPOL_CAP-0603  [C0603]
C3  0.1u  NONPOL_CAP-0603  [C0603]
C4  0.1u  NONPOL_CAP-0603  [C0603]
C5  1u  NONPOL_CAP-0603  [C0603]
C6  0.1u  NONPOL_CAP-0603  [C0603]
C7  0.1u  NONPOL_CAP-0603  [C0603]
C8  0.1u  NONPOL_CAP-0603  [C0603]
PIC1  PIC16F1786-I/SS  [SSOP28]
PICKIT  MA06-1  [MA06-1]
R1  0  RESISTOR-0603  [R0603]
R2  200  RESISTOR-0603  [R0603]
R3  200  RESISTOR-0603  [R0603]
R4  200  RESISTOR-0603  [R0603]
R5  0  RESISTOR-0603  [R0603]
R6  0  RESISTOR-0603  [R0603]
R7  0  RESISTOR-0603  [R0603]
UART  MA06-1  [MA06-1]
VREF2  REF195GSZ  [SOIC-8]

### Nets
3.3V_PL: R4.1
5V_IN: C7.1 PIC1.20(VDD) PICKIT.2
5V_PL: R2.1
5V_REF: C2.1 C8.1 PIC1.5(RA3) VREF2.6(OUTPUT)
7.5V_IN: C1.1 C5.1 VREF2.2(VS) VREF2.3(!SLEEP!)
I_LOAD: PIC1.4(RA2) R5.2
I_PDU_3.3V: PIC1.22(RB1) R7.2
I_PDU_5V: PIC1.25(RB4) R6.2
I_PV: PIC1.2(RA0) R1.2
ICSPCLK: PIC1.27(RB6/ICSPCLK) PICKIT.5
ICSPDAT: PIC1.28(RB7/ICSPDAT) PICKIT.4
IS_LOAD: R5.1
IS_PDU_3.3V: R7.1
IS_PDU_5V: R6.1
IS_PV: R1.1
MCLR: PIC1.1(!MCLR) PICKIT.1
PV_BUS: R3.1
REF: C1.2 C2.2 C3.2 C4.2 C5.2 C6.2 C7.2 C8.2 PIC1.8(VSS) PIC1.19(VSS) PICKIT.3 UART.1 VREF2.4(GND)
RX: PIC1.18(RC7) UART.4
TX: PIC1.17(RC6) UART.5
V_BUS: C3.1 PIC1.3(RA1) R3.2
V_PDU_3.3V: C6.1 PIC1.21(RB0) R4.2
V_PDU_5V: C4.1 PIC1.24(RB3) R2.2
Unconnected: PIC1.6(RA4) PIC1.7(RA5) PIC1.9(RA7) PIC1.10(RA6) PIC1.11(RC0) PIC1.12(RC1) PIC1.13(RC2) PIC1.14(RC3) PIC1.15(RC4) PIC1.16(RC5) PIC1.23(RB2) PIC1.26(RB5) PICKIT.6 UART.2 UART.3 UART.6

### Notes on the sheet
- Debugger/Programmer connector
- UART connector
- ADC filters

### Library data of the parts
C1-C8 = Pasives:NONPOL_CAP
PIC1 = ICs:PIC16F1786
PICKIT UART = Interfaces:MA06-1: PIN HEADER; OC_FARNELL: unknown; OC_NEWARK: unknown
R1-R7 = Pasives:RESISTOR: RESISTOR
VREF2 = ICs:REF195GSZ

## Module CONTROLLER$A
Ports: 5V_IN(pwr) 12V_IN(pwr) TX(io) IS_PV(io) PV_BUS(io) REF(pwr) IS_LOAD(io) TX_RELAY(io) VBAT(io) IBAT(io)
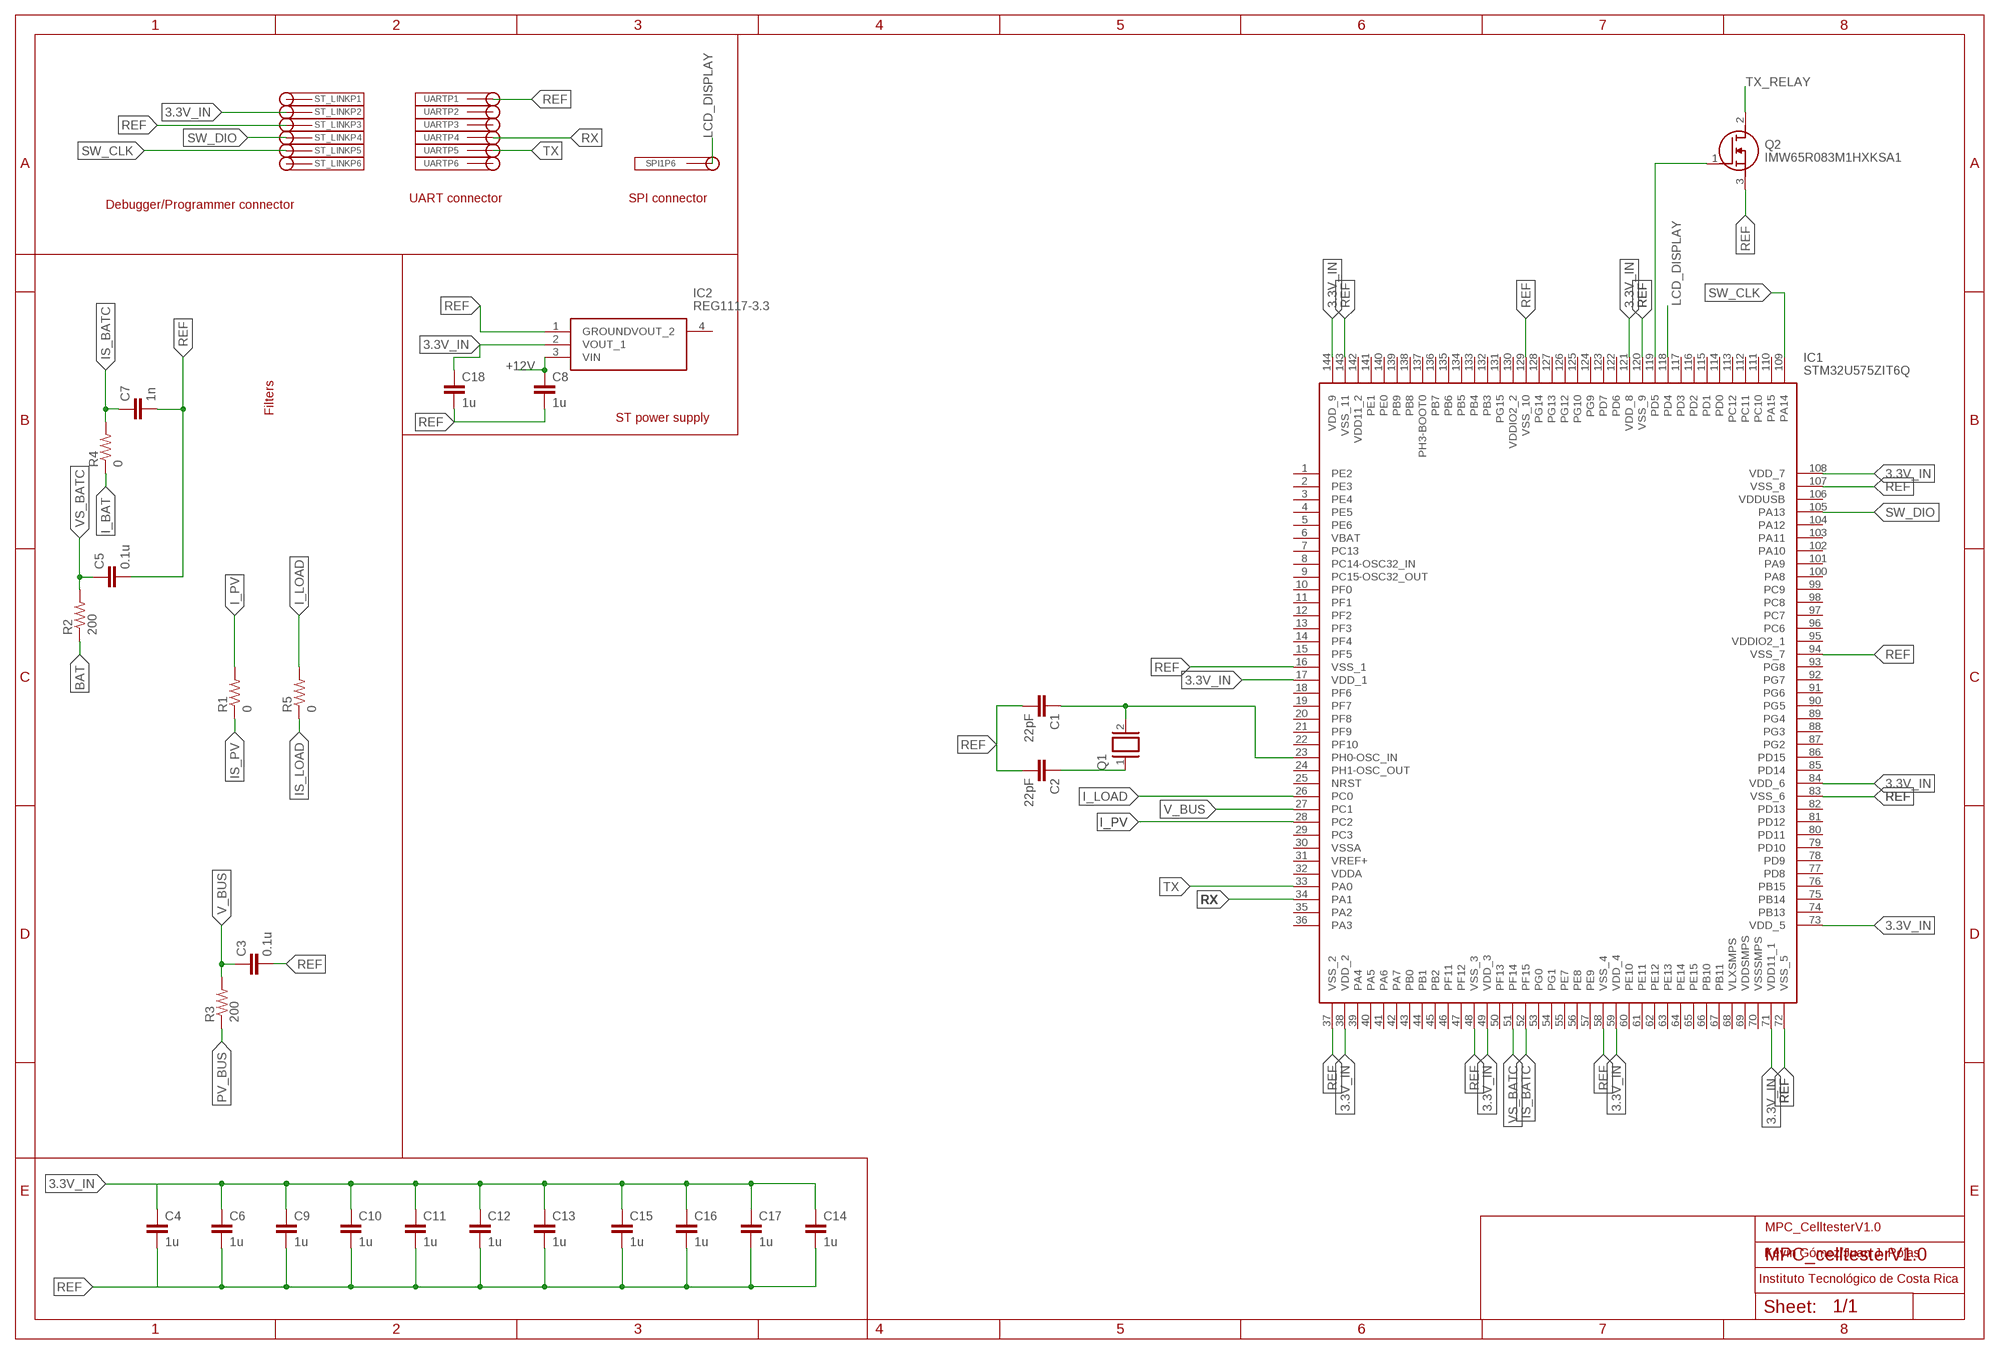
[diagram p9: schematic, module CONTROLLER$A, sheet 1]

### Parts
C1  22pF  C2.5/4  [C2.5-4]
C2  22pF  C2.5/4  [C2.5-4]
C3  0.1u  NONPOL_CAP-0603  [C0603]
C4  1u  NONPOL_CAP-0603  [C0603]
C5  0.1u  NONPOL_CAP-0603  [C0603]
C6  1u  NONPOL_CAP-0603  [C0603]
C7  1n  NONPOL_CAP-0603  [C0603]
C8  1u  NONPOL_CAP-0603  [C0603]
C9  1u  NONPOL_CAP-0603  [C0603]
C10  1u  NONPOL_CAP-0603  [C0603]
C11  1u  NONPOL_CAP-0603  [C0603]
C12  1u  NONPOL_CAP-0603  [C0603]
C13  1u  NONPOL_CAP-0603  [C0603]
C14  1u  NONPOL_CAP-0603  [C0603]
C15  1u  NONPOL_CAP-0603  [C0603]
C16  1u  NONPOL_CAP-0603  [C0603]
C17  1u  NONPOL_CAP-0603  [C0603]
C18  1u  NONPOL_CAP-0603  [C0603]
IC1  STM32U575ZIT6Q  [QFP50P2200X2200X160-144N]
IC2  REG1117-3.3  [SOT230P700X180-4N]
Q1  XTAL  [Q]
Q2  IMW65R083M1HXKSA1  [TO544P530X1590X2600-3P]
R1  0  RESISTOR-0603  [R0603]
R2  200  RESISTOR-0603  [R0603]
R3  200  RESISTOR-0603  [R0603]
R4  0  RESISTOR-0603  [R0603]
R5  0  RESISTOR-0603  [R0603]
SPI1  MA06-1  [MA06-1]
ST_LINK  MA06-1  [MA06-1]
UART  MA06-1  [MA06-1]

### Nets
3.3V_IN: C4.1 C6.1 C9.1 C10.1 C11.1 C12.1 C13.1 C14.1 C15.1 C16.1 C17.1 C18.1 IC1.17(VDD_1) IC1.38(VDD_2) IC1.49(VDD_3) IC1.59(VDD_4) IC1.71(VDD11_1) IC1.73(VDD_5) IC1.84(VDD_6) IC1.108(VDD_7) IC1.121(VDD_8) IC1.144(VDD_9) IC2.2(VOUT_1) ST_LINK.2
+12V: C8.1 IC2.3(VIN)
BAT: R2.1
I_BAT: R4.1
I_LOAD: IC1.26(PC0) R5.2
I_PV: IC1.28(PC2) R1.2
IS_BATC: C7.1 IC1.52(PF15) R4.2
IS_LOAD: R5.1
IS_PV: R1.1
LCD_DISPLAY: IC1.118(PD4) SPI1.6
N$20: C1.1 IC1.23(PH0-OSC_IN) Q1.2
N$21: C2.1 Q1.1
N$22: C1.2 C2.2
N$27: IC1.119(PD5) Q2.1(G)
N$29: C8.2 C18.2
PV_BUS: R3.1
REF: C3.2 C4.2 C5.2 C6.2 C7.2 C9.2 C10.2 C11.2 C12.2 C13.2 C14.2 C15.2 C16.2 C17.2 IC1.16(VSS_1) IC1.37(VSS_2) IC1.48(VSS_3) IC1.58(VSS_4) IC1.72(VSS_5) IC1.83(VSS_6) IC1.94(VSS_7) IC1.107(VSS_8) IC1.120(VSS_9) IC1.129(VSS_10) IC1.143(VSS_11) IC2.1(GROUND) Q2.3(S) ST_LINK.3 UART.1
RX: IC1.34(PA1) UART.4
SW_CLK: IC1.109(PA14) ST_LINK.5
SW_DIO: IC1.105(PA13) ST_LINK.4
TX: IC1.33(PA0) UART.5
TX_RELAY: Q2.2(D)
V_BUS: C3.1 IC1.27(PC1) R3.2
VS_BATC: C5.1 IC1.51(PF14) R2.2
Unconnected: IC1.1(PE2) IC1.2(PE3) IC1.3(PE4) IC1.4(PE5) IC1.5(PE6) IC1.6(VBAT) IC1.7(PC13) IC1.8(PC14-OSC32_IN) IC1.9(PC15-OSC32_OUT) IC1.10(PF0) IC1.11(PF1) IC1.12(PF2) IC1.13(PF3) IC1.14(PF4) IC1.15(PF5) IC1.18(PF6) IC1.19(PF7) IC1.20(PF8) IC1.21(PF9) IC1.22(PF10) IC1.24(PH1-OSC_OUT) IC1.25(NRST) IC1.29(PC3) IC1.30(VSSA) IC1.31(VREF+) IC1.32(VDDA) IC1.35(PA2) IC1.36(PA3) IC1.39(PA4) IC1.40(PA5) IC1.41(PA6) IC1.42(PA7) IC1.43(PB0) IC1.44(PB1) IC1.45(PB2) IC1.46(PF11) IC1.47(PF12) IC1.50(PF13) IC1.53(PG0) IC1.54(PG1) IC1.55(PE7) IC1.56(PE8) IC1.57(PE9) IC1.60(PE10) IC1.61(PE11) IC1.62(PE12) IC1.63(PE13) IC1.64(PE14) IC1.65(PE15) IC1.66(PB10) IC1.67(PB11) IC1.68(VLXSMPS) IC1.69(VDDSMPS) IC1.70(VSSSMPS) IC1.74(PB13) IC1.75(PB14) IC1.76(PB15) IC1.77(PD8) IC1.78(PD9) IC1.79(PD10) IC1.80(PD11) IC1.81(PD12) IC1.82(PD13) IC1.85(PD14) IC1.86(PD15) IC1.87(PG2) IC1.88(PG3) IC1.89(PG4) IC1.90(PG5) IC1.91(PG6) IC1.92(PG7) IC1.93(PG8) IC1.95(VDDIO2_1) IC1.96(PC6) IC1.97(PC7) IC1.98(PC8) IC1.99(PC9) IC1.100(PA8) IC1.101(PA9) IC1.102(PA10) IC1.103(PA11) IC1.104(PA12) IC1.106(VDDUSB) IC1.110(PA15) IC1.111(PC10) IC1.112(PC11) IC1.113(PC12) IC1.114(PD0) IC1.115(PD1) IC1.116(PD2) IC1.117(PD3) IC1.122(PD6) IC1.123(PD7) IC1.124(PG9) IC1.125(PG10) IC1.126(PG12) IC1.127(PG13) IC1.128(PG14) IC1.130(VDDIO2_2) IC1.131(PG15) IC1.132(PB3) IC1.133(PB4) IC1.134(PB5) IC1.135(PB6) IC1.136(PB7) IC1.137(PH3-BOOT0) IC1.138(PB8) IC1.139(PB9) IC1.140(PE0) IC1.141(PE1) IC1.142(VDD11_2) IC2.4(VOUT_2) SPI1.1 SPI1.2 SPI1.3 SPI1.4 SPI1.5 ST_LINK.1 ST_LINK.6 UART.2 UART.3 UART.6

### Notes on the sheet
- UART connector | SPI connector
- Debugger/Programmer connector
- Filters
- ST power supply
- MPC_CelltesterV1.0
- Kevin Gómez/Juan J. Rojas
- Instituto Tecnológico de Costa Rica

### Library data of the parts
C1 C2 = capacitor-wima:C: CAPACITOR naming: grid - package width
C3-C18 = Pasives:NONPOL_CAP
IC1 = STM32U575ZIT6Q:STM32U575ZIT6Q: ARM Microcontrollers - MCU Ultra-low-power FPU Arm Cortex-M33 Trust Zone, MCU 160 MHz 2Mbytes Flash memory Source: Datasheet <https://www.st.com/resource/en/datasheet/stm32u575zi.pdf>; DESCRIPTION: ARM Microcontrollers - MCU Ultra-low-power FPU Arm Cortex-M33 Trust Zone, MCU 160 MHz 2Mbytes Flash memory; HEIGHT: 1.6mm; MANUFACTURER_NAME: STMicroelectronics; MANUFACTURER_PART_NUMBER: STM32U575ZIT6Q; MOUSER_PART_NUMBER: 511-STM32U575ZIT6Q; MOUSER_PRICE-STOCK: https://www.mouser.co.uk/ProductDetail/STMicroelectronics/STM32U575ZIT6Q?qs=DRkmTr78QAQiyS5FForRwQ%3D%3D
IC2 = REG1117-3.3:REG1117-3.3: 800mA,3.3V,LDO Voltage Reg.,REG1117-3.3 Texas Instruments REG1117-3.3, LDO Voltage Regulator, 0.8A, 3.3 V +/-1%, 3.8 15 Vin, 4-Pin SOT-223 Source: Datasheet <https://datasheet.datasheetarchive.com/originals/distributors/Datasheets-SFU2/DSASFU100026654.pdf>; ARROW_PART_NUMBER: REG1117-3.3; ARROW_PRICE-STOCK: https://www.arrow.com/en/products/reg1117-3.3/texas-instruments?region=nac; DESCRIPTION: 800mA,3.3V,LDO Voltage Reg.,REG1117-3.3 Texas Instruments REG1117-3.3, LDO Voltage Regulator, 0.8A, 3.3 V +/-1%, 3.8 15 Vin, 4-Pin SOT-223; HEIGHT: 1.8mm; MANUFACTURER_NAME: Texas Instruments; MANUFACTURER_PART_NUMBER: REG1117-3.3; MOUSER_PART_NUMBER: 595-REG1117-3.3; MOUSER_PRICE-STOCK: https://www.mouser.co.uk/ProductDetail/Texas-Instruments/REG1117-3.3?qs=sSOk4GDDv7y9bL0tER%2FZXw%3D%3D
Q1 = special:XTAL: CRYSTAL
Q2 = IMW65R083M1HXKSA1:IMW65R083M1HXKSA1: CoolSiC MOSFET 650V SiC MOSFET delivering reliable and cost-effective performance in TO247 3pin package Source: Datasheet <https://www.infineon.com/dgdl/Infineon-IMW65R083M1H-DataSheet-v02_00-EN.pdf?fileId=5546d4627862c3e501786e1ef0e93c85>; DESCRIPTION: CoolSiC MOSFET 650V SiC MOSFET delivering reliable and cost-effective performance in TO247 3pin package; HEIGHT: 5.3mm; MANUFACTURER_NAME: Infineon; MANUFACTURER_PART_NUMBER: IMW65R083M1HXKSA1; MOUSER_PART_NUMBER: 726-IMW65R083M1HXKSA; MOUSER_PRICE-STOCK: https://www.mouser.co.uk/ProductDetail/Infineon-Technologies/IMW65R083M1HXKSA1?qs=iLbezkQI%252Bshnhe4LfuFU5w%3D%3D
R1-R5 = Pasives:RESISTOR: RESISTOR
SPI1 ST_LINK UART = Interfaces:MA06-1: PIN HEADER; OC_FARNELL: unknown; OC_NEWARK: unknown